# EasyEDA Pro project G-CU.eprj

# Schematic Schematic1
Manufacturer Part: BH-18650-B1BA002; Supplier Part: C2988620; Create Date: 2023-06-21; Page Name: P1; Project Name: G-CU; Schematic Name: Schematic1; Update Date: 2024-05-16; Company: 嘉立创EDA; Page Size: A4; Version: V1.0
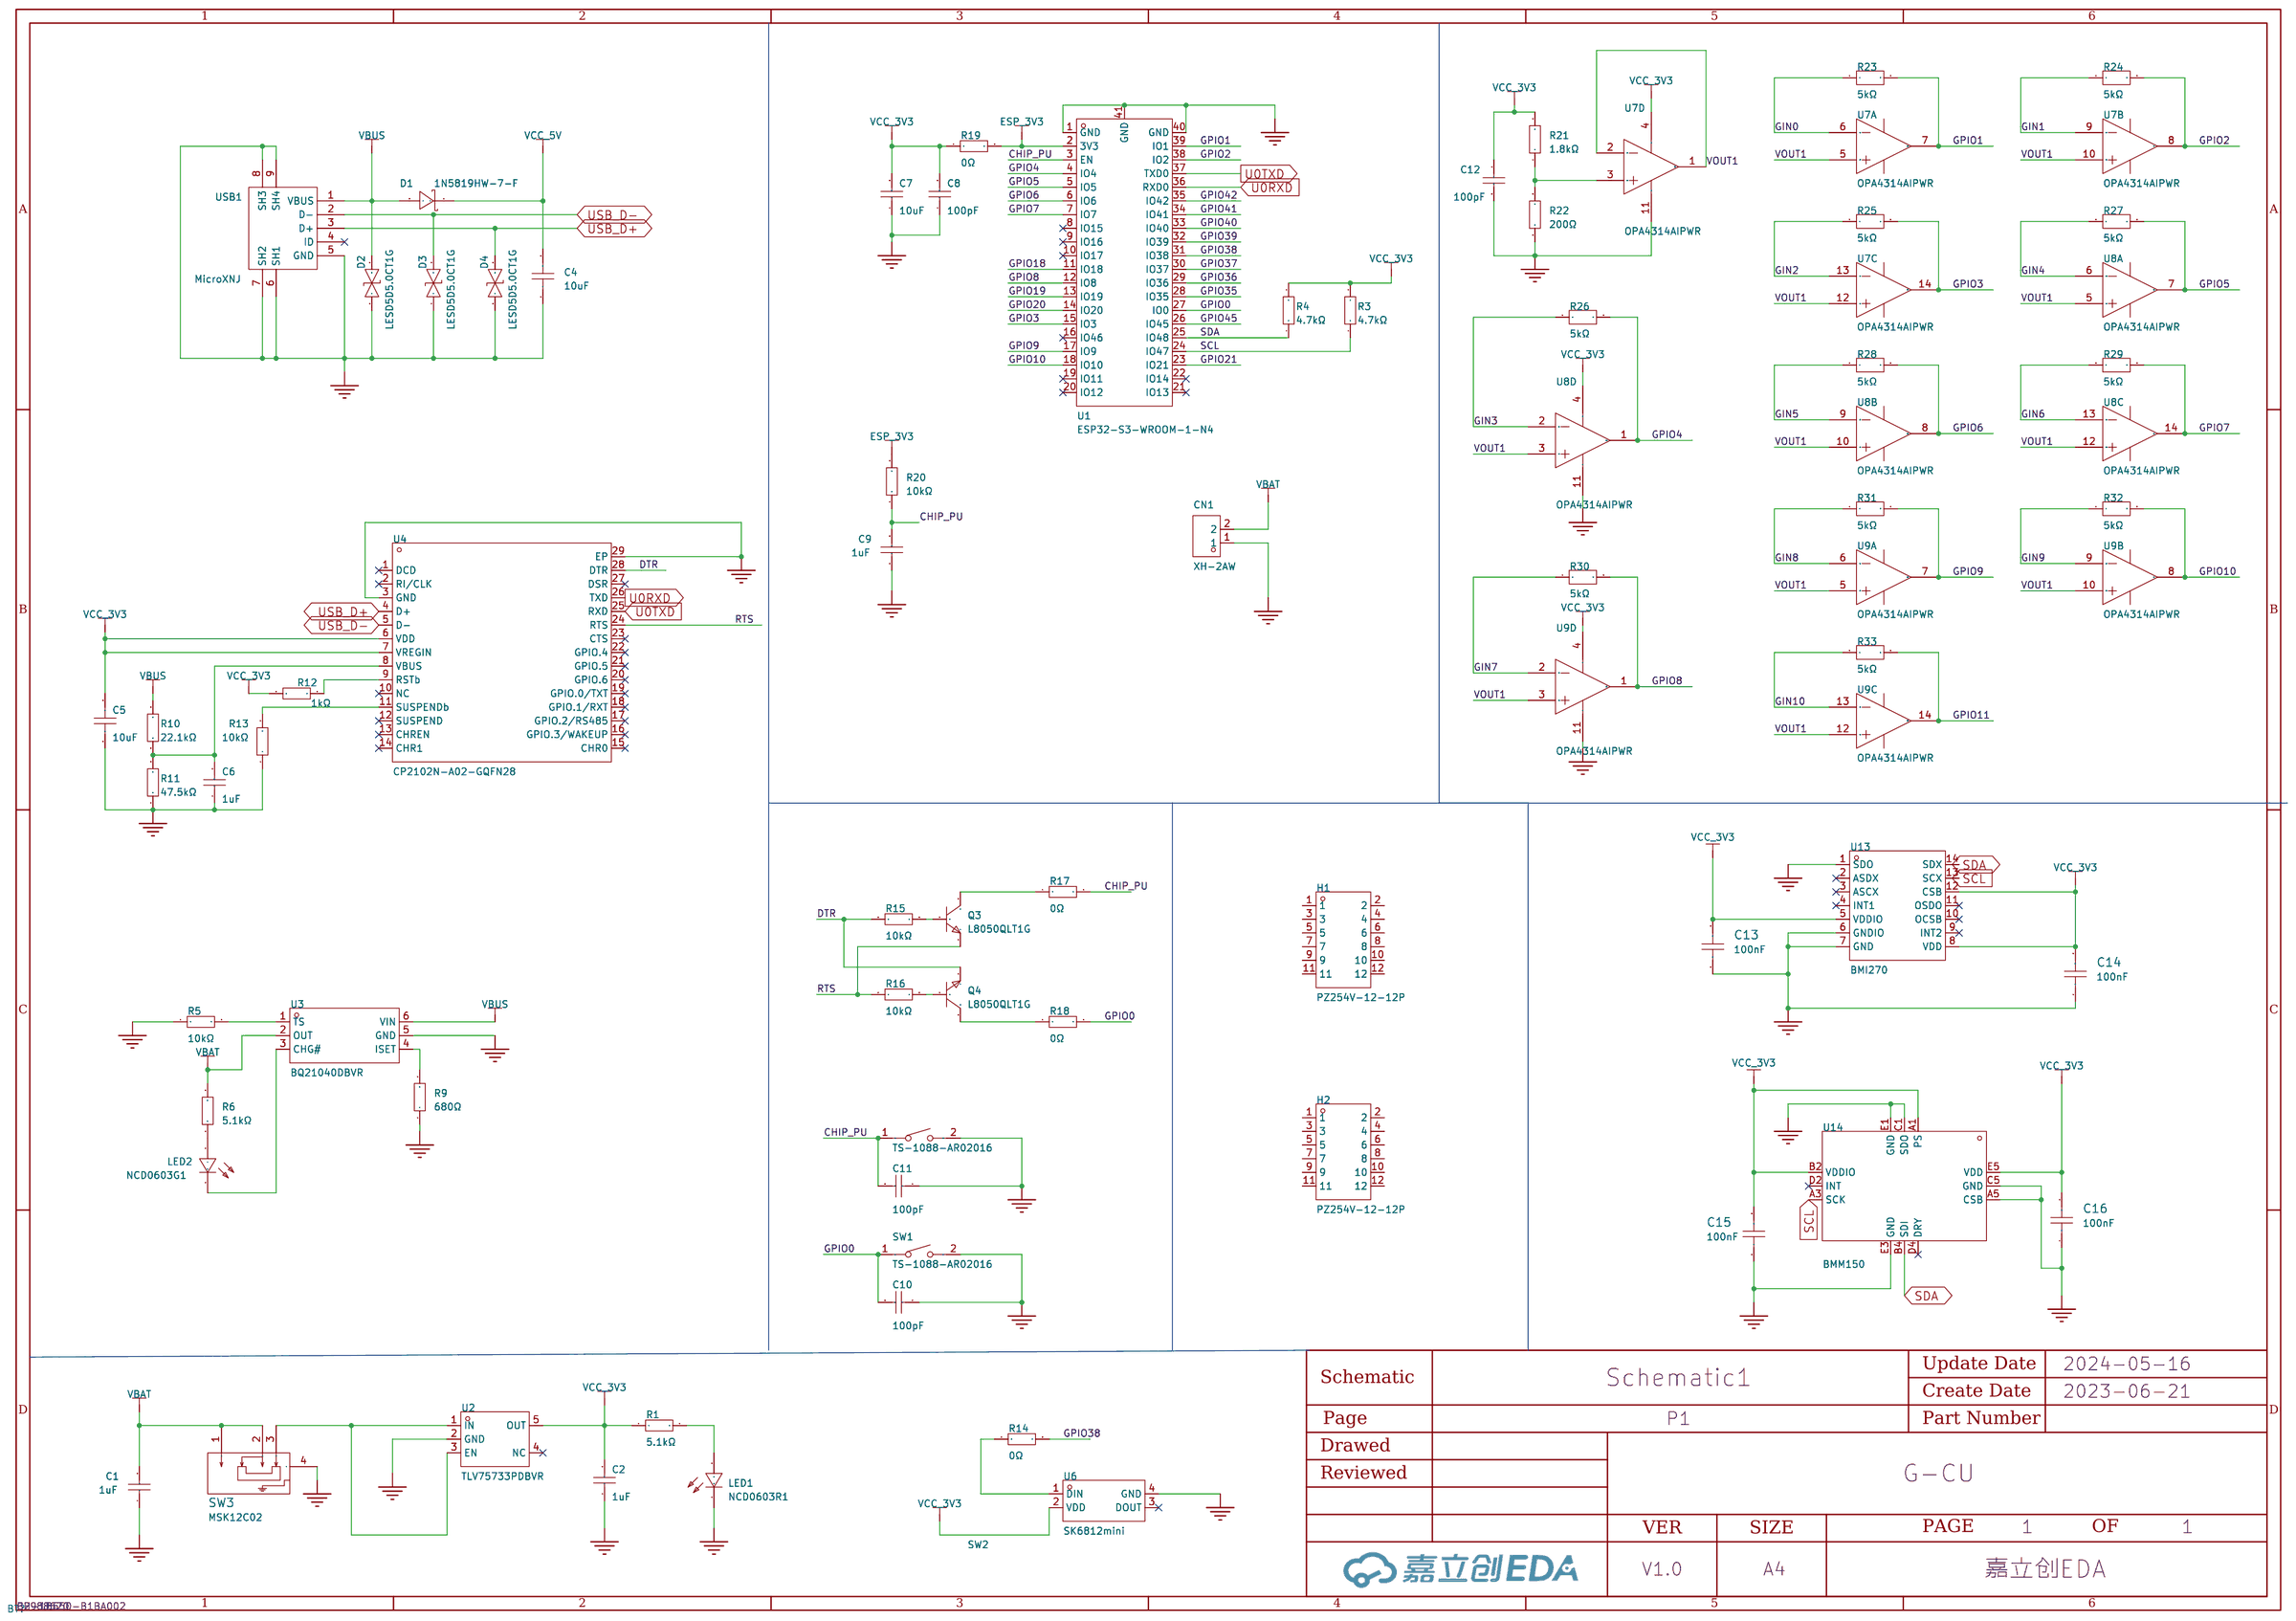
[diagram p0: schematic sheet]

## Parts
C1  1uF  [C0402]
C2  1uF  [C0402]
C4  10uF  [C0603]
C5  10uF  [C0603]
C6  1uF  [C0603]
C7  10uF  [C0402]
C8  100pF  [C0402]
C9  1uF  [C0402]
C10  100pF  [C0402]
C11  100pF  [C0402]
C12  100pF  [C0402]
C13  100nF  [C0402]
C14  100nF  [C0402]
C15  100nF  [C0402]
C16  100nF  [C0402]
CN1  XH-2AW  [CONN-TH_XH-2AW_C2908611]
D1  1N5819HW-7-F  [SOD-123_L2.7-W1.6-LS3.7-RD]
D2  LESD5D5.0CT1G  [SOD-523_L1.2-W0.8-LS1.6-BI]
D3  LESD5D5.0CT1G  [SOD-523_L1.2-W0.8-LS1.6-BI]
D4  LESD5D5.0CT1G  [SOD-523_L1.2-W0.8-LS1.6-BI]
H1  PZ254V-12-12P  [GCU-CON-v2]
H2  PZ254V-12-12P  [GCU-CON-v2]
LED1  NCD0603R1  [LED0603-RD_RED]
LED2  NCD0603G1  [LED0603-RD]
Q3  L8050QLT1G  [SOT-23-3_L2.9-W1.3-P1.90-LS2.4-BR]
Q4  L8050QLT1G  [SOT-23-3_L2.9-W1.3-P1.90-LS2.4-BR]
R1  5.1kΩ  [R0402]
R3  4.7kΩ  [R0402]
R4  4.7kΩ  [R0402]
R5  10kΩ  [R0402]
R6  5.1kΩ  [R0402]
R9  680Ω  [R0402]
R10  22.1kΩ  [R0402]
R11  47.5kΩ  [R0402]
R12  1kΩ  [R0402]
R13  10kΩ  [R0402]
R14  0Ω  [R0402]
R15  10kΩ  [R0402]
R16  10kΩ  [R0402]
R17  0Ω  [R0402]
R18  0Ω  [R0402]
R19  0Ω  [R0402]
R20  10kΩ  [R0402]
R21  1.8kΩ  [R0402]
R22  200Ω  [R0402]
R23  5kΩ  [R0603]
R24  5kΩ  [R0603]
R25  5kΩ  [R0603]
R26  5kΩ  [R0603]
R27  5kΩ  [R0603]
R28  5kΩ  [R0603]
R29  5kΩ  [R0603]
R30  5kΩ  [R0603]
R31  5kΩ  [R0603]
R32  5kΩ  [R0603]
R33  5kΩ  [R0603]
SW1  TS-1088-AR02016  [SW-SMD_L3.9-W3.0-P4.45]
SW2  TS-1088-AR02016  [SW-SMD_L3.9-W3.0-P4.45]
SW3  MSK12C02  [SW-TH_MSK12C02]
U1  ESP32-S3-WROOM-1-N4  [WIRELM-SMD_ESP32-S3-WROOM-1]
U2  TLV75733PDBVR  [SOT-23-5_L2.9-W1.6-P0.95-LS2.8-BL]
U3  BQ21040DBVR  [SOT-23-6_L2.9-W1.6-P0.95-LS2.8-BR]
U4  CP2102N-A02-GQFN28  [QFN-28_L5.0-W5.0-P0.50-TL-EP3.3]
U6  SK6812mini  [LED-SMD_4P-L3.7-W3.5-P1.75-BR-SK6812MINI]
U7  OPA4314AIPWR  [TSSOP-14_L5.0-W4.4-P0.65-LS6.4-BL]  (sections 1,2,3,4)
U8  OPA4314AIPWR  [TSSOP-14_L5.0-W4.4-P0.65-LS6.4-BL]  (sections 1,2,3,4)
U9  OPA4314AIPWR  [TSSOP-14_L5.0-W4.4-P0.65-LS6.4-BL]  (sections 1,2,3,4)
U13  BMI270  [LGA-14_L3.0-W2.5-P0.50-BR]
U14  BMM150  [WLCSP-12_L1.6-W1.6_BMM150]
USB1  MicroXNJ  [MICRO-USB-SMD_MICROXNJ]

## Library data of the parts
C1 C2 C9 = CL05A105KP5NNNC: 容值:1uF;精度:±10%;额定电压:10V;材质(温度系数):X5R;; LCSC Part Name: 1uF ±10% 10V; Supplier Part: C14445; Manufacturer: SAMSUNG(三星); Supplier Footprint: 0402; JLCPCB Part Class: Extended Part; Datasheet: https://atta.szlcsc.com/upload/public/pdf/source/20160103/1457707670698.pdf; Supplier: LCSC; Tolerance: ±10%; Voltage Rated: 10V; Temperature Coefficient: X5R
C4 C5 = CL10A106MA8NRNC: 容值:10uF;精度:±20%;额定电压:25V;材质(温度系数):X5R;; LCSC Part Name: 10uF ±20% 25V; Supplier Part: C96446; Manufacturer: SAMSUNG(三星); Supplier Footprint: 0603; JLCPCB Part Class: Basic Part; Datasheet: https://atta.szlcsc.com/upload/public/pdf/source/20170325/1490427913016.pdf; Supplier: LCSC; Tolerance: ±20%; Voltage Rated: 25V; Temperature Coefficient: X5R
C6 = CL10A105KO8NNNC: 容值:1uF;精度:±10%;额定电压:16V;材质(温度系数):X5R;; LCSC Part Name: 1uF ±10% 16V; Supplier Part: C1592; Manufacturer: SAMSUNG(三星); Supplier Footprint: 0603; JLCPCB Part Class: Extended Part; Datasheet: https://atta.szlcsc.com/upload/public/pdf/source/20220919/9FBE606BE0D9532D730F292EB26DC5BB.pdf; Supplier: LCSC; Tolerance: ±10%; Voltage Rated: 16V; Temperature Coefficient: X5R
C7 = CL05A106MQ5NUNC: 容值:10uF;精度:±20%;额定电压:6.3V;材质(温度系数):X5R;; LCSC Part Name: 10uF ±20% 6.3V; Supplier Part: C15525; Manufacturer: SAMSUNG(三星); Supplier Footprint: 0402; JLCPCB Part Class: Basic Part; Datasheet: https://atta.szlcsc.com/upload/public/pdf/source/20220823/2B02EE04F8F211D38A52DCB16EB6BEBA.pdf; Supplier: LCSC; Tolerance: ±20%; Voltage Rated: 6.3V; Temperature Coefficient: X5R
C8 C10-C12 = 0402CG101J500NT: 容值:100pF;精度:±5%;额定电压:50V;材质(温度系数):C0G;; LCSC Part Name: 100pF ±5% 50V; Supplier Part: C1546; Manufacturer: FH(风华); Supplier Footprint: 0402; JLCPCB Part Class: Basic Part; Datasheet: https://atta.szlcsc.com/upload/public/pdf/source/20170923/C1546_1506149265265988353.pdf; Supplier: LCSC; Tolerance: ±5%; Voltage Rated: 50V; Temperature Coefficient: C0G
C13-C16 = FCC0402B104K250AT: 容值:100nF;精度:±10%;额定电压:25V;材质(温度系数):X7R;; LCSC Part Name: 100nF ±10% 25V; Supplier Part: C5137489; Manufacturer: FOJAN(富捷); Supplier Footprint: 0402; JLCPCB Part Class: 扩展库; Datasheet: https://atta.szlcsc.com/upload/public/pdf/source/20220818/0EB3B7FB2F5648AC16609637FBA7DABE.pdf; Supplier: LCSC; Tolerance: ±10%; Voltage Rated: 25V; Temperature Coefficient: X7R
CN1 = XH-2AW_C2908611: 参考系列:XH;间距:2.54mm;插针结构:1x2P;排数:1;每排PIN数:2;行距:-;公母:公型插针;安装方式:弯插;额定电流:3A;工作温度范围:-25℃~+85℃;; LCSC Part Name: XH 2.54mm 1x2P 弯插; Supplier Part: C2908611; Manufacturer: HCTL(华灿天禄); Supplier Footprint: 弯插,P=2.54mm; JLCPCB Part Class: 扩展库; Datasheet: https://atta.szlcsc.com/upload/public/pdf/source/20211021/ACA2D54D99493880102FCACAC8DAABA8.pdf; Supplier: LCSC; Reference Series: XH; Pitch: 2.54mm; Pins Structure: 1x2P; Number of Rows: 1; Number of PINs Per Row: 2; Gender: 公型插针; Mounting Style: 弯插; Current Rating (Max): 3A; Operating Temperature Range: -25℃~+85℃
D1 = 1N5819HW-7-F: 直流反向耐压(Vr):40V;平均整流电流(Io):1A;正向压降(Vf):450mV@1A;; LCSC Part Name: 40V 1A 450mV@1A; Supplier Part: C82544; Manufacturer: DIODES(美台); Supplier Footprint: SOD-123; JLCPCB Part Class: Extended Part; Datasheet: https://atta.szlcsc.com/upload/public/pdf/source/20161024/1477288459223.pdf; Supplier: LCSC; Reverse Voltage (Vr): 40V; Average Rectified Current (Io): 1A; Forward Voltage (Vf@If): 450mV@1A
D2-D4 = LESD5D5.0CT1G: 极性:双向;反向截止电压(Vrwm):5V;击穿电压(VBR):5.6V;钳位电压(Vc)@Ipp:18.6V;; LCSC Part Name: 双向ESD; Supplier Part: C383211; Manufacturer: LRC(乐山无线电); Supplier Footprint: SOD-523; JLCPCB Part Class: Extended Part; Datasheet: https://atta.szlcsc.com/upload/public/pdf/source/20190807/C383211_633DF4B4E2C161403226E5235FE33A1C.pdf; Supplier: LCSC; Polarity: 双向; Reverse Stand-Off Voltage (Vrwm): 5V; Breakdown Voltage (VBR): 5.6V; Peak Pulse Current(Ipp)@8/20us: 9.4A; Clamping Voltage@Ipp: 18.6V
H1 H2 = PZ254V-12-12P: 插针结构:2x6P;间距:2.54mm;行距:2.54mm;圆针/方针:方针;安装类型:直插;排数:双排;总PIN位数:12P;额定电流:-;额定电压:-;配合针长度:6mm;塑高:2.5mm;端接针长度:3mm;触头材质:黄铜;触头镀层:-;工作温度范围:-40℃~+105℃;颜色:黑色;; LCSC Part Name: 间距:2.54mm 2x6P 直插 方针; Supplier Part: C492423; Manufacturer: XFCN(兴飞); Supplier Footprint: 插件,P=2.54mm; JLCPCB Part Class: 扩展库; Datasheet: https://atta.szlcsc.com/upload/public/pdf/source/20200309/C492423_E4E2C9BC0EB9D59A2ABE4377D2E234B2.pdf; Supplier: LCSC; Pin Structure: 2x6P; Pitch: 2.54mm; Row Spacing: 2.54mm; Circluar Pins/Square Pins: 方针; Mounting Type: 直插; Number of Rows: 双排; Number of Pins: 12P; Length of Mating Pin: 6mm; Insulation Height: 2.5mm; Length of End Connection Pin: 3mm; Contact Material: 黄铜; Operating Temperature Range: -40℃~+105℃; Color: 黑色
LED1 = NCD0603R1_C84263: 发光颜色:红灯;; LCSC Part Name: 红灯; Supplier Part: C84263; Manufacturer: 国星光电; Supplier Footprint: 0603; JLCPCB Part Class: Extended Part; Datasheet: https://atta.szlcsc.com/upload/public/pdf/source/20200820/C84263_DABC6A75E58F576973B407FDBA283D60.pdf; Supplier: LCSC; Emitted Color: 红灯
LED2 = NCD0603G1: 发光颜色:翠绿;; LCSC Part Name: 翠绿; Supplier Part: C84267; Manufacturer: 国星光电; Supplier Footprint: 0603; JLCPCB Part Class: Extended Part; Datasheet: https://atta.szlcsc.com/upload/public/pdf/source/20200820/C84267_04BA7703640BAC111D09F5EFB971FBF3.pdf; Supplier: LCSC; Emitted Color: 翠绿
Q3 Q4 = L8050QLT1G: 晶体管类型:NPN;集射极击穿电压(Vceo):25V;集电极电流(Ic):800mA;功率(Pd):225mW;; LCSC Part Name: NPN 25V 800mA; Supplier Part: C49581; Manufacturer: LRC(乐山无线电); Supplier Footprint: SOT-23; JLCPCB Part Class: Extended Part; Datasheet: https://atta.szlcsc.com/upload/public/pdf/source/20150518/1457707314424.pdf; Supplier: LCSC; Transistor Type: NPN; Collector-Emitter Breakdown Voltage (Vceo): 25V; Collector Current (Ic): 800mA; Power Dissipation (Pd): 225mW
R1 R6 = 0402WGF5101TCE: 电阻类型:厚膜电阻;阻值:5.1kΩ;精度:±1%;功率:62.5mW;; LCSC Part Name: 5.1kΩ ±1% 62.5mW; Supplier Part: C25905; Manufacturer: UNI-ROYAL(厚声); Supplier Footprint: 0402; JLCPCB Part Class: Basic Part; Datasheet: https://atta.szlcsc.com/upload/public/pdf/source/20200306/C422600_1E6D84923E4A46A82E41ADD87F860B5C.pdf; Supplier: LCSC; Type: 厚膜电阻; Tolerance: ±1%; Power(Watts): 62.5mW; Temperature Coefficient: ±100ppm/℃; Overload Voltage (Max): 50V; Operating Temperature Range: -55℃~+155℃
R3 R4 = 0402WGF4701TCE: 电阻类型:厚膜电阻;阻值:4.7kΩ;精度:±1%;功率:62.5mW;; LCSC Part Name: 4.7kΩ ±1% 62.5mW; Supplier Part: C25900; Manufacturer: UNI-ROYAL(厚声); Supplier Footprint: 0402; JLCPCB Part Class: Basic Part; Datasheet: https://atta.szlcsc.com/upload/public/pdf/source/20200306/C422600_1E6D84923E4A46A82E41ADD87F860B5C.pdf; Supplier: LCSC; Type: 厚膜电阻; Tolerance: ±1%; Power(Watts): 62.5mW; Temperature Coefficient: ±100ppm/℃; Overload Voltage (Max): 50V; Operating Temperature Range: -55℃~+155℃
R5 R13 R15 R16 R20 = 0402WGF1002TCE: 电阻类型:厚膜电阻;阻值:10kΩ;精度:±1%;功率:62.5mW;; LCSC Part Name: 10kΩ ±1% 62.5mW; Supplier Part: C25744; Manufacturer: UNI-ROYAL(厚声); Supplier Footprint: 0402; JLCPCB Part Class: Basic Part; Datasheet: https://atta.szlcsc.com/upload/public/pdf/source/20200306/C422600_1E6D84923E4A46A82E41ADD87F860B5C.pdf; Supplier: LCSC; Type: 厚膜电阻; Tolerance: ±1%; Power(Watts): 62.5mW; Temperature Coefficient: ±100ppm/℃; Overload Voltage (Max): 50V; Operating Temperature Range: -55℃~+155℃
R9 = 0402WGF6800TCE: 电阻类型:厚膜电阻;阻值:680Ω;精度:±1%;功率:62.5mW;; LCSC Part Name: 680Ω ±1% 62.5mW; Supplier Part: C25130; Manufacturer: UNI-ROYAL(厚声); Supplier Footprint: 0402; JLCPCB Part Class: Basic Part; Datasheet: https://atta.szlcsc.com/upload/public/pdf/source/20200306/C422600_1E6D84923E4A46A82E41ADD87F860B5C.pdf; Supplier: LCSC; Type: 厚膜电阻; Tolerance: ±1%; Power(Watts): 62.5mW; Temperature Coefficient: ±100ppm/℃; Overload Voltage (Max): 50V; Operating Temperature Range: -55℃~+155℃
R10 = 0402WGF2212TCE: 电阻类型:厚膜电阻;阻值:22.1kΩ;精度:±1%;功率:62.5mW;; LCSC Part Name: 22.1kΩ ±1% 62.5mW; Supplier Part: C43473; Manufacturer: UNI-ROYAL(厚声); Supplier Footprint: 0402; JLCPCB Part Class: Extended Part; Datasheet: https://atta.szlcsc.com/upload/public/pdf/source/20200306/C422600_1E6D84923E4A46A82E41ADD87F860B5C.pdf; Supplier: LCSC; Type: 厚膜电阻; Tolerance: ±1%; Power(Watts): 62.5mW; Temperature Coefficient: ±100ppm/℃; Overload Voltage (Max): 50V; Operating Temperature Range: -55℃~+155℃
R11 = 0402WGF4752TCE: 电阻类型:厚膜电阻;阻值:47.5kΩ;精度:±1%;功率:62.5mW;; LCSC Part Name: 47.5kΩ ±1% 62.5mW; Supplier Part: C25896; Manufacturer: UNI-ROYAL(厚声); Supplier Footprint: 0402; JLCPCB Part Class: Extended Part; Datasheet: https://atta.szlcsc.com/upload/public/pdf/source/20200306/C422600_1E6D84923E4A46A82E41ADD87F860B5C.pdf; Supplier: LCSC; Type: 厚膜电阻; Tolerance: ±1%; Power(Watts): 62.5mW; Temperature Coefficient: ±100ppm/℃; Overload Voltage (Max): 50V; Operating Temperature Range: -55℃~+155℃
R12 = 0402WGF1001TCE: 电阻类型:厚膜电阻;阻值:1kΩ;精度:±1%;功率:62.5mW;; LCSC Part Name: 1kΩ ±1% 62.5mW; Supplier Part: C11702; Manufacturer: UNI-ROYAL(厚声); Supplier Footprint: 0402; JLCPCB Part Class: Basic Part; Datasheet: https://atta.szlcsc.com/upload/public/pdf/source/20200306/C422600_1E6D84923E4A46A82E41ADD87F860B5C.pdf; Supplier: LCSC; Type: 厚膜电阻; Tolerance: ±1%; Power(Watts): 62.5mW; Temperature Coefficient: ±100ppm/℃; Overload Voltage (Max): 50V; Operating Temperature Range: -55℃~+155℃
R14 R17-R19 = 0402WGJ0000TCE: 电阻类型:厚膜电阻;阻值:0Ω;精度:±5%;功率:62.5mW;; LCSC Part Name: 0Ω ±5% 62.5mW; Supplier Part: C21376; Manufacturer: UNI-ROYAL(厚声); Supplier Footprint: 0402; JLCPCB Part Class: Extended Part; Datasheet: https://atta.szlcsc.com/upload/public/pdf/source/20200306/C422600_1E6D84923E4A46A82E41ADD87F860B5C.pdf; Supplier: LCSC; Type: 厚膜电阻; Tolerance: ±5%; Power(Watts): 62.5mW; Overload Voltage (Max): 50V; Operating Temperature Range: -55℃~+155℃
R21 = 0402WGF1801TCE: 电阻类型:厚膜电阻;阻值:1.8kΩ;精度:±1%;功率:62.5mW;; LCSC Part Name: 1.8kΩ ±1% 62.5mW; Supplier Part: C25871; Manufacturer: UNI-ROYAL(厚声); Supplier Footprint: 0402; JLCPCB Part Class: Extended Part; Datasheet: https://atta.szlcsc.com/upload/public/pdf/source/20200306/C422600_1E6D84923E4A46A82E41ADD87F860B5C.pdf; Supplier: LCSC; Type: 厚膜电阻; Tolerance: ±1%; Power(Watts): 62.5mW; Temperature Coefficient: ±100ppm/℃; Overload Voltage (Max): 50V; Operating Temperature Range: -55℃~+155℃
R22 = 0402WGF2000TCE: 电阻类型:厚膜电阻;阻值:200Ω;精度:±1%;功率:62.5mW;; LCSC Part Name: 200Ω ±1% 62.5mW; Supplier Part: C25087; Manufacturer: UNI-ROYAL(厚声); Supplier Footprint: 0402; JLCPCB Part Class: Basic Part; Datasheet: https://atta.szlcsc.com/upload/public/pdf/source/20200306/C422600_1E6D84923E4A46A82E41ADD87F860B5C.pdf; Supplier: LCSC; Type: 厚膜电阻; Tolerance: ±1%; Power(Watts): 62.5mW; Temperature Coefficient: ±100ppm/℃; Overload Voltage (Max): 50V; Operating Temperature Range: -55℃~+155℃
R23-R33 = AR03BTCX5001: 电阻类型:薄膜电阻;阻值:5kΩ;精度:±0.1%;功率:100mW;; LCSC Part Name: 5kΩ ±0.1% 100mW; Supplier Part: C2828621; Manufacturer: Viking(光颉); Supplier Footprint: 0603; JLCPCB Part Class: Extended Part; Datasheet: https://atta.szlcsc.com/upload/public/pdf/source/20211009/C2828621_7F88408CB1D09DFC08036051E0A6050B.pdf; Supplier: LCSC; Type: 薄膜电阻; Tolerance: ±0.1%; Power(Watts): 100mW; Temperature Coefficient: ±25ppm/℃; Overload Voltage (Max): 50V; Operating Temperature Range: -55℃~+155℃
SW1 SW2 = TS-1088-AR02016: 触点电流:50mA;额定电压(DC):12V;绝缘电阻:100MΩ;电路结构:单刀单掷;安装方式:立贴;作用力:160gf@±50gf;机械寿命:10万次;带支架:否;; LCSC Part Name: 4*3*2mm 立贴 轻触开关; Supplier Part: C720477; Manufacturer: XUNPU(讯普); Supplier Footprint: SMD; JLCPCB Part Class: Extended Part; Datasheet: https://atta.szlcsc.com/upload/public/pdf/source/20200810/C720475_60D09DD6C54279ADDB2DC25100F1CC11.pdf; Supplier: LCSC; Contact Current: 50mA; Voltage Rating (DC): 12V; Insulation Resistance: 100MΩ; Circuit: 单刀单掷; Mounting Style: 立贴; Actuator Style: 圆形按钮; Actuator/Cap Color: 黑色; Operating Force: 160gf@±50gf; Mechanical Life: 10万次; Operating Temperature: -30℃~+80℃; Pin Style: SMD接片; Switch Length: 4mm; Switch Width: 3mm; Switch Height: 2mm; Strike Gundam: 否
SW3 = MSK12C02: LCSC Part Name: 两档侧拨贴片 7脚 拨动 白柄 柄长1.5mm,带定位柱; Supplier Part: C431540; Manufacturer: SHOU HAN(首韩); Supplier Footprint: SMD; JLCPCB Part Class: 扩展库; Supplier: LCSC
U1 = ESP32-S3-WROOM-1: LCSC Part Name: ESP32-S2-SOLO-2-N4; Supplier Part: C2913197; Manufacturer: ESPRESSIF(乐鑫); JLCPCB Part Class: Extended Part; Datasheet: https://atta.szlcsc.com/upload/public/pdf/source/20220829/68E69EF550BFD22B9418B9E05FF4E453.pdf; Supplier: LCSC
U2 = TLV75733PDBVR: 输出类型:固定;输出极性:正;输出通道数:1;最大输入电压:5.5V;输出电压:3.3V;压差:475mV@(1A);输出电流:1A;电源纹波抑制比(PSRR):52dB;; LCSC Part Name: 正 Vin=5.5V Vout=3.3V 1A 52dB; Supplier Part: C485517; Manufacturer: TI(德州仪器); Supplier Footprint: SOT-23-5; JLCPCB Part Class: Extended Part; Datasheet: https://atta.szlcsc.com/upload/public/pdf/source/20200225/C485517_6B29D09EDAFD9A781E45EE8E3C6E09A4.pdf; Supplier: LCSC; Output Type: 固定; Output Polarity: 正; Number of Outputs: 1; Maximum Input Voltage: 5.5V; Output Voltage: 3.3V; Dropout Voltage: 475mV@(1A); Output Current: 1A; Power Supply Rejection Ratio (PSRR): 52dB
U3 = BQ21040DBVR: 电池类型:锂离子/聚合物;电池节数:1;最大充电电流:800mA;电源电压:6.45V;; Supplier Part: C202311; Manufacturer: TI(德州仪器); Supplier Footprint: SOT-23-6; JLCPCB Part Class: Extended Part; Datasheet: https://atta.szlcsc.com/upload/public/pdf/source/20180412/C202311_69E9FC455D67F52C33ED3C60972DCB90.pdf; Supplier: LCSC; Type of Battery: 锂离子/聚合物; Number of Cells: 1; Maximum Charge Current: 800mA; Supply Voltage: 6.45V; Operating Temperature: 0℃~+125℃
U4 = CP2102N-A02-GQFN28: Supplier Part: C1550553; Manufacturer: SILICON LABS(芯科); Supplier Footprint: QFN-28(5x5); JLCPCB Part Class: Extended Part; Datasheet: https://atta.szlcsc.com/upload/public/pdf/source/20201204/C964632_F2B790CC23A72455AEF523510305B30A.pdf; Supplier: LCSC
U6 = SK6812mini: Supplier Part: C2886570; Manufacturer: 欧思科光电; Supplier Footprint: SMD; JLCPCB Part Class: Extended Part; Datasheet: https://atta.szlcsc.com/upload/public/pdf/source/20230417/4A68877D1EE94768BDE7A1DE8196F30D.pdf; Supplier: LCSC
U7-U9 = OPA4314AIPWR: OPA4314 四路、3MHz、低功耗、低噪声、RRI/O、1.8V CMOS 运算放大器; Supplier Part: C129333; Manufacturer: TI(德州仪器); Supplier Footprint: TSSOP-14; JLCPCB Part Class: Extended Part; Datasheet: https://atta.szlcsc.com/upload/public/pdf/source/20170914/C129333_1505359967979968173.pdf; Supplier: LCSC
U13 = BMI270: IMU-惯性测量单元; Supplier Part: C2836813; Manufacturer: Bosch(博世); Supplier Footprint: LGA-14(2.5x3); JLCPCB Part Class: 扩展库; Datasheet: https://atta.szlcsc.com/upload/public/pdf/source/20210625/C2836813_35E1F3F92097F45A3828DF13DDBA01A5.pdf; Supplier: LCSC
U14 = BMM150: 磁传感器 3轴磁罗盘; LCSC Part Name: 三轴地磁式传感器; Supplier Part: C171681; Manufacturer: Bosch(博世); Supplier Footprint: WLCSP-12; JLCPCB Part Class: 扩展库; Datasheet: https://atta.szlcsc.com/upload/public/pdf/source/20180327/C171681_AC95244FE88EF9D8F701E0ABF38F9AC1.pdf; Supplier: LCSC
USB1 = MicroXNJ: 连接器类型:Micro-B;标准:USB 2.0;公母:母座;触点数量:5;端口数量:1;安装方式:卧贴;额定电流 - 电源:1A;工作温度范围:-20℃~+85℃;; LCSC Part Name: Micro-B 母座 卧贴; Supplier Part: C404969; Manufacturer: SHOU HAN(首韩); Supplier Footprint: SMD; JLCPCB Part Class: Extended Part; Datasheet: https://atta.szlcsc.com/upload/public/pdf/source/20220415/2494EDFF499AF6F852F7C820374B6AF3.pdf; Supplier: LCSC; Connector Type: Micro-B; Standard: USB 2.0; Gender: 母座; Number of Contacts: 5; Number of Ports: 1; Mounting Style: 卧贴; Current Rating - Power (Max): 1A; Operating Temperature Range: -20℃~+85℃

## Nets
GND: C1.1 C2.1 C4.1 C5.1 C6.1 C7.1 C8.1 C9.1 C10.1 C11.1 C12.2 C13.1 C14.1 C15.1 C16.1 CN1.1 D2.1 D3.1 D4.1 LED1.1(K) R5.1 R9.1 R11.1 R13.1 R22.1 SW1.2 SW2.2 SW3.4 U1.1(GND) U1.40(GND) U1.41(GND) U2.2(GND) U3.5(GND) U4.3(GND) U4.29(EP) U6.4(GND) U7.11(V-) U8.11(V-) U9.11(V-) U13.1(SDO) U13.6(GNDIO) U13.7(GND) U14.A5(CSB) U14.C1(SDO) U14.C5(GND) U14.E1(GND) U14.E3(GND) USB1.5(GND) USB1.6(SH1) USB1.7(SH2) USB1.8(SH3) USB1.9(SH4)
VBAT: C1.2 CN1.2 R6.2 SW3.1 SW3.2 U3.2(OUT)
VBUS: D1.2(A) D2.2 R10.2 U3.6(VIN) USB1.1(VBUS)
VCC_3V3: C2.2 C5.2 C7.2 C8.2 C12.1 C13.2 C14.2 C15.2 C16.2 R1.1 R3.2 R4.2 R12.2 R19.1 R21.2 U2.5(OUT) U4.6(VDD) U4.7(VREGIN) U6.2(VDD) U7.4(V+) U8.4(V+) U9.4(V+) U13.5(VDDIO) U13.8(VDD) U13.12(CSB) U14.A1(PS) U14.B2(VDDIO) U14.E5(VDD)
VCC_5V: C4.2 D1.1(K)
CHIP_PU: C9.2 C11.2 R17.2 R20.1 SW2.1 U1.3(EN)
DTR: Q4.2(E) R15.1 U4.28(DTR)
ESP_3V3: R19.2 R20.2 U1.2(3V3)
GIN0: R23.1 U7.6(IN B-)
GIN1: R24.1 U7.9(IN C-)
GIN2: R25.1 U7.13(IN D-)
GIN3: R26.1 U8.2(IN A-)
GIN4: R27.1 U8.6(IN B-)
GIN5: R28.1 U8.9(IN C-)
GIN6: R29.1 U8.13(IN D-)
GIN7: R30.1 U9.2(IN A-)
GIN8: R31.1 U9.6(IN B-)
GIN9: R32.1 U9.9(IN C-)
GIN10: R33.1 U9.13(IN D-)
GPIO0: C10.2 R18.2 SW1.1 U1.27(IO0)
GPIO1: R23.2 U1.39(IO1) U7.7(OUT B)
GPIO2: R24.2 U1.38(IO2) U7.8(OUT C)
GPIO3: R25.2 U1.15(IO3) U7.14(OUT D)
GPIO4: R26.2 U1.4(IO4) U8.1(OUT A)
GPIO5: R27.2 U1.5(IO5) U8.7(OUT B)
GPIO6: R28.2 U1.6(IO6) U8.8(OUT C)
GPIO7: R29.2 U1.7(IO7) U8.14(OUT D)
GPIO8: R30.2 U1.12(IO8) U9.1(OUT A)
GPIO9: R31.2 U1.17(IO9) U9.7(OUT B)
GPIO10: R32.2 U1.18(IO10) U9.8(OUT C)
GPIO11: R33.2 U9.14(OUT D)
GPIO18: U1.11(IO18)
GPIO19: U1.13(IO19)
GPIO20: U1.14(IO20)
GPIO21: U1.23(IO21)
GPIO35: U1.28(IO35)
GPIO36: U1.29(IO36)
GPIO37: U1.30(IO37)
GPIO38: R14.2 U1.31(IO38)
GPIO39: U1.32(IO39)
GPIO40: U1.33(IO40)
GPIO41: U1.34(IO41)
GPIO42: U1.35(IO42)
GPIO45: U1.26(IO45)
RTS: Q3.2(E) R16.1 U4.24(RTS)
SCL: R3.1 U1.24(IO47) U13.13(SCX) U14.A3(SCK)
SDA: R4.1 U1.25(IO48) U13.14(SDX) U14.B4(SDI)
U0RXD: U1.36(RXD0) U4.26(TXD)
U0TXD: U1.37(TXD0) U4.25(RXD)
USB_D+: D4.2 U4.4(D+) USB1.3(D+)
USB_D-: D3.2 U4.5(D-) USB1.2(D-)
VOUT1: U7.1(OUT A) U7.2(IN A-) U7.5(IN B+) U7.10(IN C+) U7.12(IN D+) U8.3(IN A+) U8.5(IN B+) U8.10(IN C+) U8.12(IN D+) U9.3(IN A+) U9.5(IN B+) U9.10(IN C+) U9.12(IN D+)
$1N2540: LED1.2(A) R1.2
$1N5698: R5.2 U3.1(TS)
$1N5744: LED2.2(A) R6.1
$1N5776: LED2.1(K) U3.3(CHG#)
$1N6032: R9.2 U3.4(ISET)
$1N7305: C6.2 R10.1 R11.2 U4.8(VBUS)
$1N7502: R12.1 U4.9(RSTb)
$1N7540: R13.2 U4.11(SUSPENDb)
$1N7794: R14.1 U6.1(DIN)
$1N8190: Q3.3(C) R17.1
$1N8194: Q4.3(C) R18.1
$1N8229: Q3.1(B) R15.2
$1N8232: Q4.1(B) R16.2
$1N11489: R21.1 R22.2 U7.3(IN A+)
$1N12314: SW3.3 U2.1(IN) U2.3(EN)

Not connected (* = marked no-connect by the designer): H1 1 2 3 4 5 6 7 8 9 10 11 12; H2 1 2 3 4 5 6 7 8 9 10 11 12; U1 8(IO15)* 9(IO16)* 10(IO17)* 16(IO46)* 19(IO11)* 20(IO12)* 21(IO13)* 22(IO14)*; U2 4(NC)*; U4 1(DCD)* 2(RI/CLK)* 10(NC)* 12(SUSPEND)* 13(CHREN)* 14(CHR1)* 15(CHR0)* 16(GPIO.3/WAKEUP)* 17(GPIO.2/RS485)* 18(GPIO.1/RXT)* 19(GPIO.0/TXT)* 20(GPIO.6)* 21(GPIO.5)* 22(GPIO.4)* 23(CTS)* 27(DSR)*; U6 3(DOUT)*; U13 2(ASDX)* 3(ASCX)* 4(INT1)* 9(INT2)* 10(OCSB)* 11(OSDO)*; U14 D2(INT)* D4(DRY)*; USB1 4(ID)*

# Board PCB1
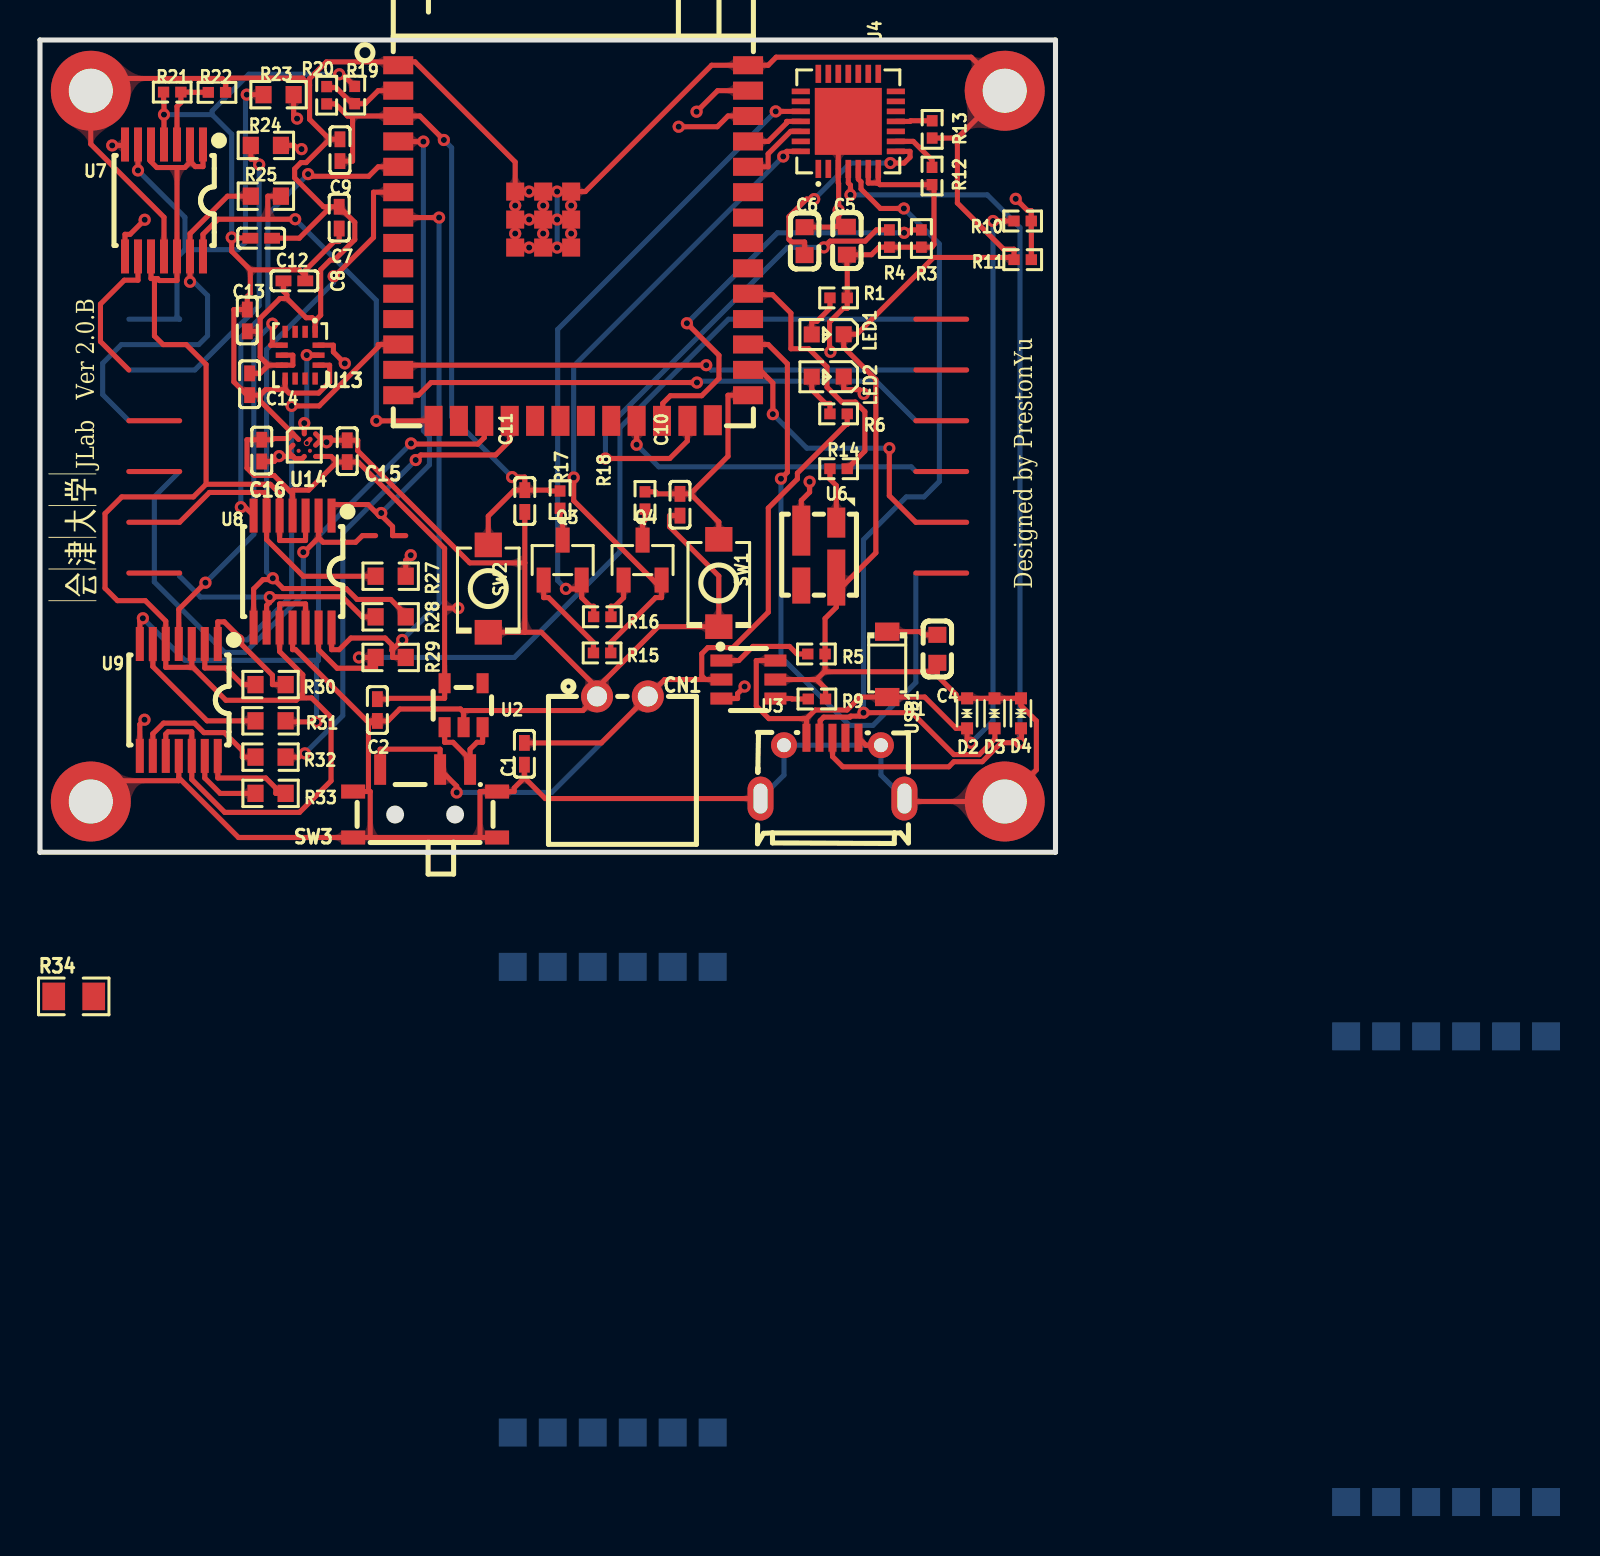
[diagram p1: board, top side]
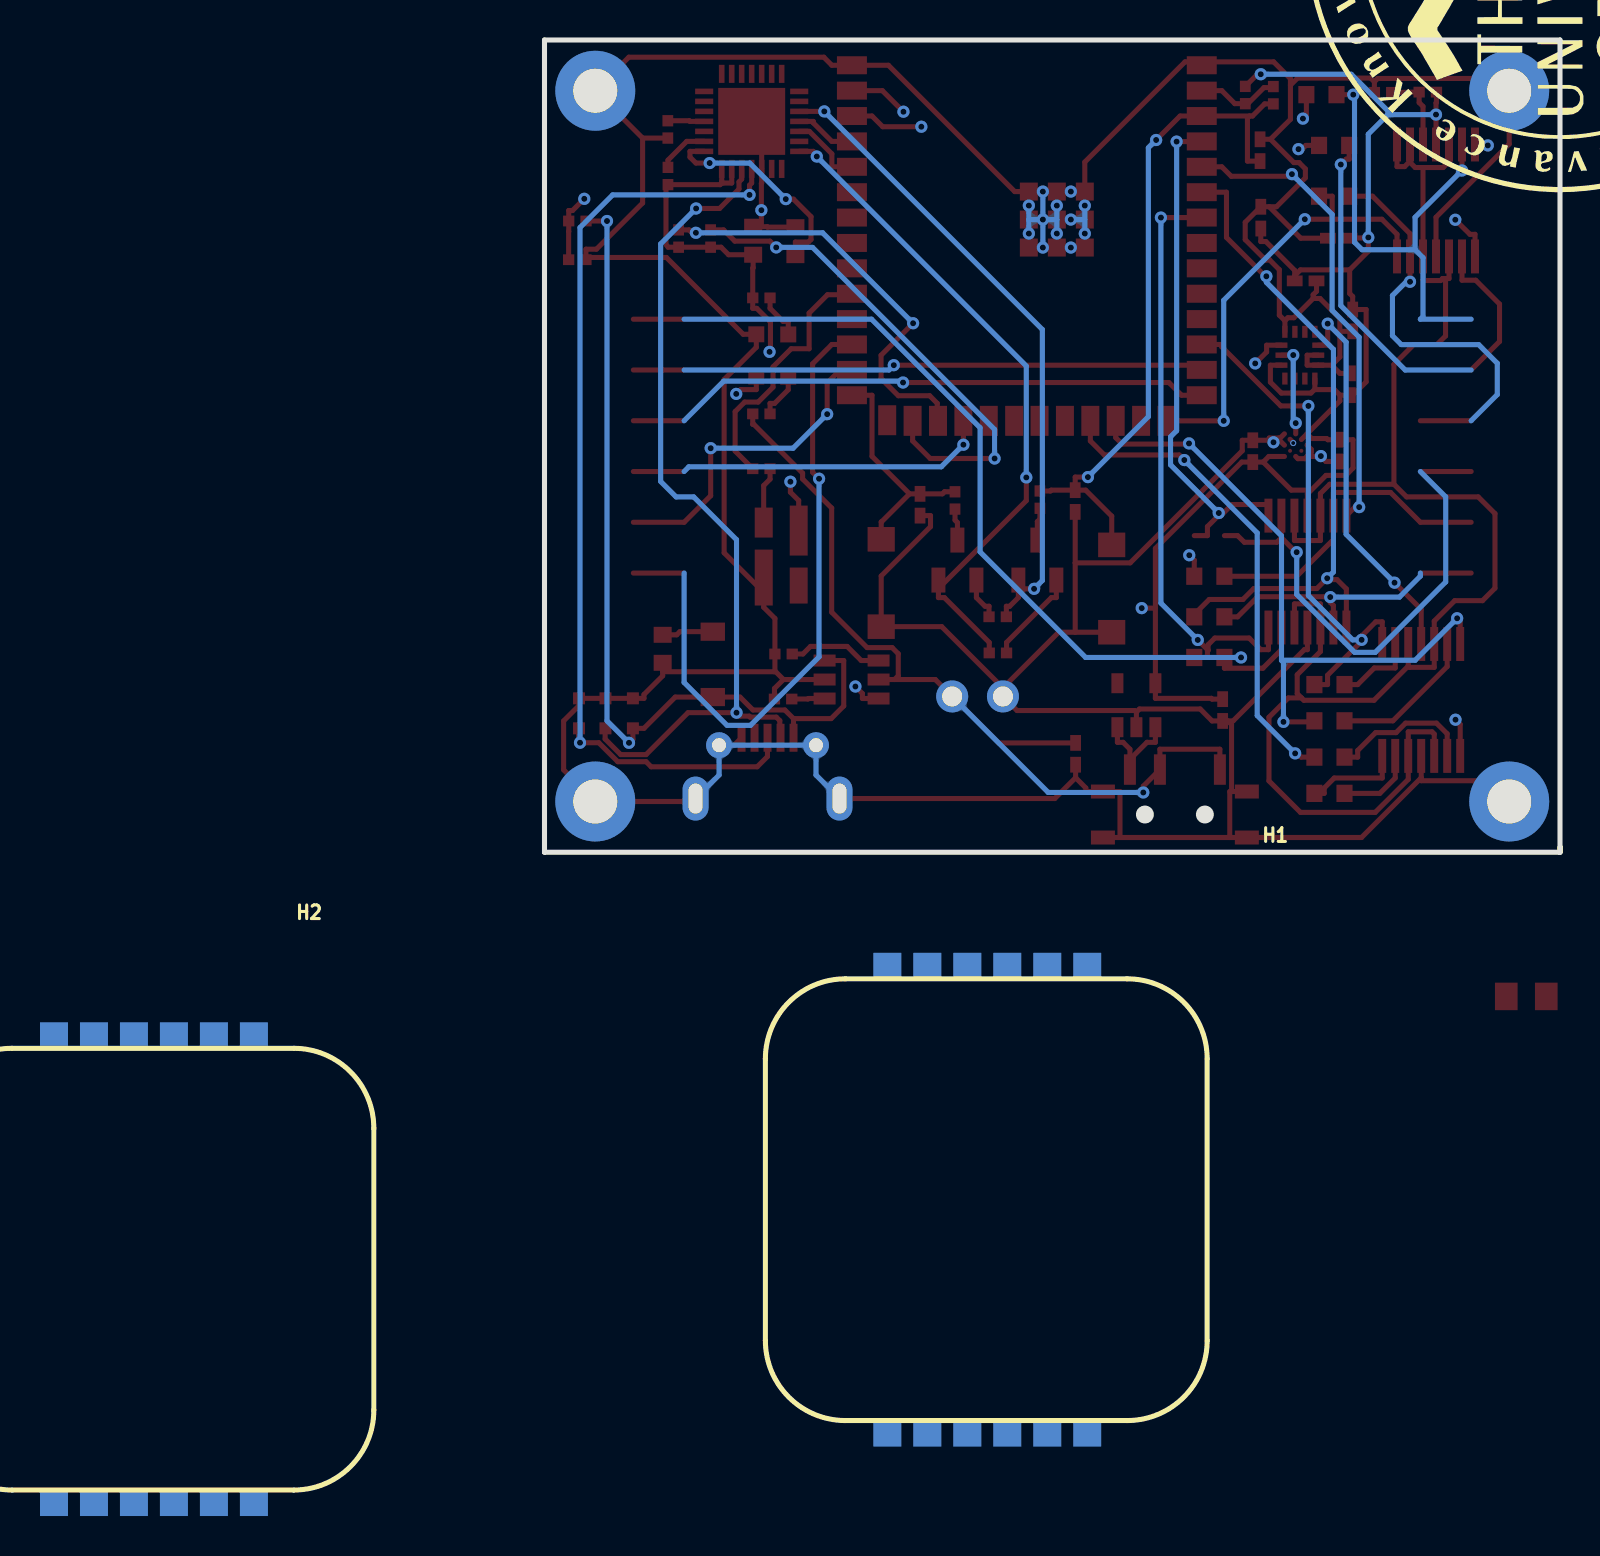
[diagram p2: board, bottom side, seen from below]

Outline 50.8 x 40.64 mm; copper layers: Top Layer, 地线屏蔽层, 信号层1, Bottom Layer. Coordinates in mm from the lower left corner of the outline.
Outline path: 0,40.64 0,0 50.8,0 50.8,40.64 0,40.64
Stack: Top Layer 0.035mm 外层铜厚1oz / Dielectric1 0.2104mm 7628 RC49% 8.6mil / 地线屏蔽层 0.035mm - / Dielectric2 1.065mm 1.1mm H/HOZ 含铜 / 信号层1 0.035mm - / Dielectric3 0.2104mm 7628 RC49% 8.6mil / Bottom Layer 0.035mm 外层铜厚1oz

## Design rules (mm)
template: JLCPCB Capability(Multiple Layers Board)
spacing copperThickness1oz (default): track to track 0.102, other pairs 0.152 to 0.3
spacing copperThickness2oz: track to track 0.203, other pairs 0.152 to 0.3
spacing copperThicknessInner0.5oz: track to track 0.089, other pairs 0.152 to 0.3
track width copperThickness1oz (default): min 0.102, default 0.254, max 2.54
track width copperThickness2oz: min 0.203, default 0.254, max 2.54
track width copperThickness0.5oz: min 0.089, default 0.254, max 2.54
differential pair differentialPair (default): width min 0.127, default 0.254, max 2.54; gap min 0.152, default 0.152
via viaSize (default): diameter min 0.3, default 0.61, max 10; hole min 0.2, default 0.305, max 6.3

## Placement (name value [footprint] x y rotation side)
C1  1uF  [c0402]  24.23 4.93 90 top
C2  1uF  [C0402]  16.88 7.11 90 top
C4  10uF  [C0603]  44.89 10.18 90 top
C5  10uF  [C0603]  40.36 30.59 270 top
C6  1uF  [C0603]  38.25 30.57 270 top
C7  10uF  [C0402]  14.97 31.75 270 top
C8  100pF  [C0402]  12.73 28.59 0 top
C9  1uF  [C0402]  15.01 35.12 270 top
C10  100pF  [C0402]  32.02 17.39 90 top
C11  100pF  [C0402]  24.25 17.57 90 top
C12  100pF  [C0402]  11.07 30.72 0 top
C13  100nF  [C0402]  10.37 26.61 90 top
C14  100nF  [C0402]  10.49 23.41 270 top
C15  100nF  [C0402]  15.37 20.07 270 top
C16  100nF  [C0402]  11.09 20.09 90 top
CN1  XH-2AW  [CONN-TH_XH-2AW_C2908611]  29.14 7.8 0 top
D1  1N5819HW-7-F  [SOD-123_L2.7-W1.6-LS3.7-RD]  42.38 9.4 270 top
D2  LESD5D5.0CT1G  [SOD-523_L1.2-W0.8-LS1.6-BI]  46.38 6.95 270 top
D3  LESD5D5.0CT1G  [SOD-523_L1.2-W0.8-LS1.6-BI]  47.75 6.95 270 top
D4  LESD5D5.0CT1G  [SOD-523_L1.2-W0.8-LS1.6-BI]  49.07 6.95 270 top
H1  PZ254V-12-12P  [GCU-CON-v2]  17.65 -6.33 270 bottom
H2  PZ254V-12-12P  [GCU-CON-v2]  59.34 -9.81 270 bottom
LED1  NCD0603R1  [LED0603-RD_RED]  39.41 25.91 180 top
LED2  NCD0603G1  [LED0603-RD]  39.41 23.8 180 top
NOREF  -  [Pad_e33]  2.54 2.54 0 top
NOREF#2  -  [Pad_e21]  48.26 2.54 0 top
NOREF#3  -  [Pad_e35]  48.26 38.1 0 top
NOREF#4  -  [Pad_e19]  2.54 38.1 0 top
Q3  L8050QLT1G  [SOT-23-3_L2.9-W1.3-P1.90-LS2.4-BR]  26.15 14.62 270 top
Q4  L8050QLT1G  [SOT-23-3_L2.9-W1.3-P1.90-LS2.4-BR]  30.14 14.62 270 top
R1  5.1kΩ  [R0402]  39.95 27.74 180 top
R3  4.7kΩ  [R0402]  44.09 30.7 270 top
R4  4.7kΩ  [R0402]  42.49 30.7 270 top
R5  10kΩ  [R0402]  38.84 9.92 180 top
R6  5.1kΩ  [R0402]  39.95 21.93 0 top
R9  680Ω  [R0402]  38.86 7.67 180 top
R10  22.1kΩ  [R0402]  49.16 31.58 180 top
R11  47.5kΩ  [R0402]  49.16 29.65 0 top
R12  1kΩ  [R0402]  44.62 33.83 270 top
R13  10kΩ  [R0402]  44.63 36.16 90 top
R14  0Ω  [R0402]  39.95 19.19 0 top
R15  10kΩ  [R0402]  28.12 9.97 180 top
R16  10kΩ  [R0402]  28.13 11.78 0 top
R17  0Ω  [R0402]  26.02 17.64 90 top
R18  0Ω  [R0402]  30.27 17.6 90 top
R19  0Ω  [R0402]  15.74 37.88 270 top
R20  10kΩ  [R0402]  14.34 37.87 90 top
R21  1.8kΩ  [R0402]  6.61 38.03 180 top
R22  200Ω  [R0402]  8.85 38.02 180 top
R23  5kΩ  [R0603]  11.93 37.9 0 top
R24  5kΩ  [R0603]  11.3 35.36 0 top
R25  5kΩ  [R0603]  11.3 32.82 0 top
R27  5kΩ  [R0603]  17.54 13.81 0 top
R28  5kΩ  [R0603]  17.54 11.78 0 top
R29  5kΩ  [R0603]  17.54 9.75 0 top
R30  5kΩ  [R0603]  11.53 8.39 0 top
R31  5kΩ  [R0603]  11.53 6.57 0 top
R32  5kΩ  [R0603]  11.53 4.76 0 top
R33  5kΩ  [R0603]  11.53 2.95 0 top
R34  10kΩ  [R0805]  1.69 -7.21 0 top
SW1  TS-1088-AR02016  [SW-SMD_L3.9-W3.0-P4.45]  33.96 13.47 270 top
SW2  TS-1088-AR02016  [SW-SMD_L3.9-W3.0-P4.45]  22.43 13.19 270 top
SW3  MSK12C02  [SW-TH_MSK12C02]  19.27 2.44 0 top
U1  ESP32-S3-WROOM-1-N4  [WIRELM-SMD_ESP32-S3-WROOM-1]  26.67 30.48 0 top
U2  TLV75733PDBVR  [SOT-23-5_L2.9-W1.6-P0.95-LS2.8-BL]  21.19 7.36 0 top
U3  BQ21040DBVR  [SOT-23-6_L2.9-W1.6-P0.95-LS2.8-BR]  35.44 8.64 180 top
U4  CP2102N-A02-GQFN28  [QFN-28_L5.0-W5.0-P0.50-TL-EP3.3]  40.44 36.57 90 top
U6  SK6812mini  [LED-SMD_4P-L3.7-W3.5-P1.75-BR-SK6812MINI]  38.96 14.92 90 top
U7  OPA4314AIPWR  [TSSOP-14_L5.0-W4.4-P0.65-LS6.4-BL]  6.2 32.61 180 top
U8  OPA4314AIPWR  [TSSOP-14_L5.0-W4.4-P0.65-LS6.4-BL]  12.64 14.04 180 top
U9  OPA4314AIPWR  [TSSOP-14_L5.0-W4.4-P0.65-LS6.4-BL]  6.94 7.62 180 top
U13  BMI270  [LGA-14_L3.0-W2.5-P0.50-BR]  13.01 24.87 90 top
U14  BMM150  [WLCSP-12_L1.6-W1.6_BMM150]  13.22 20.37 90 top
USB1  MicroXNJ  [MICRO-USB-SMD_MICROXNJ]  39.64 4.21 0 top

## Footprints (pads in the part's own frame, mm; a bottom-side part is the same pattern mirrored in y, then rotated)
c0402
  rect 0.79x0.54 smd: 1(-0.545,0) 2(0.545,0)
C0402
  rect 0.79x0.54 smd: 1(-0.545,0) 2(0.545,0)
C0603
  rect 0.8x0.9 smd: 1(-0.7,0) 2(0.7,0)
CONN-TH_XH-2AW_C2908611
  round 1.6 hole 1: 1(-1.27,0) 2(1.27,0)
GCU-CON-v2
  rect 1.4x1.4 smd: 1(-0.6,-6) 2(-0.6,-8) 3(-0.6,-10) 4(-0.6,-12) 5(-0.6,-14) 6(-0.6,-16) 7(22.7,-16) 8(22.7,-14) 9(22.7,-12) 10(22.7,-10) 11(22.7,-8) 12(22.7,-6)
LED0603-RD
  rect 0.8x0.8 smd: 1(-0.799,-0.004) 2(0.799,0.004)
LED0603-RD_RED
  rect 0.8x0.8 smd: 1(-0.799,-0.004) 2(0.799,0.004)
LED-SMD_4P-L3.7-W3.5-P1.75-BR-SK6812MINI
  rect 1.5x0.9 smd: 1(1.575,-0.875)
  rect 2.5x0.9 smd: 2(1.175,0.875)
  rect 1.8x0.9 smd: 3(-1.575,0.875)
  rect 2.8x0.9 smd: 4(-1.175,-0.875)
LGA-14_L3.0-W2.5-P0.50-BR
  rect 0.6x0.27 smd: 1(1.17,-0.75) 2(1.17,-0.25) 3(1.17,0.25) 4(1.17,0.75) 8(-1.17,0.75) 9(-1.17,0.25) 10(-1.17,-0.25) 11(-1.17,-0.75)
  rect 0.27x0.6 smd: 5(0.5,0.92) 6(0,0.92) 7(-0.5,0.92) 12(-0.5,-0.92) 13(0,-0.92) 14(0.5,-0.92)
MICRO-USB-SMD_MICROXNJ
  rect 0.4x1.4 smd: 1(-1.3,1.522) 2(-0.65,1.522) 3(0,1.522) 4(0.65,1.522) 5(1.3,1.522)
  round 1.3 hole 0.7: 6(2.425,1.149) 9(-2.425,1.149)
  oval 1.3x2.2 hole 0.7x1.5: 7(3.6,-1.522) 8(-3.6,-1.522)
Pad_e19
  round 4 hole 2.2: 42(0,0)
Pad_e21
  round 4 hole 2.2: 42(0,0)
Pad_e33
  round 4 hole 2.2: 42(0,0)
Pad_e35
  round 4 hole 2.2: 42(0,0)
QFN-28_L5.0-W5.0-P0.50-TL-EP3.3
  rect 0.905x0.28 smd: 1(-2.377,1.5) 2(-2.377,1) 3(-2.377,0.5) 4(-2.377,0) 5(-2.377,-0.5) 6(-2.377,-1) 7(-2.377,-1.5) 15(2.377,-1.5) 16(2.377,-1) 17(2.377,-0.5) 18(2.377,0) 19(2.377,0.5) 20(2.377,1) 21(2.377,1.5)
  rect 0.28x0.905 smd: 8(-1.5,-2.377) 9(-1,-2.377) 10(-0.5,-2.377) 11(0,-2.377) 12(0.5,-2.377) 13(1,-2.377) 14(1.5,-2.377) 22(1.5,2.377) 23(1,2.377) 24(0.5,2.377) 25(0,2.377) 26(-0.5,2.377) 27(-1,2.377) 28(-1.5,2.377)
  rect 3.35x3.35 smd: 29(0,0)
R0402
  rect 0.566x0.54 smd: 1(-0.433,0) 2(0.433,0)
R0603
  rect 0.806x0.864 smd: 1(-0.753,0) 2(0.753,0)
R0805
  rect 1.133x1.377 smd: 1(-1,0) 2(1,0)
SOD-123_L2.7-W1.6-LS3.7-RD
  rect 0.91x1.22 smd: 1(-1.635,0) 2(1.635,0)
SOD-523_L1.2-W0.8-LS1.6-BI
  rect 0.6x0.6 smd: 1(-0.75,0) 2(0.75,0)
SOT-23-3_L2.9-W1.3-P1.90-LS2.4-BR
  rect 1.25x0.7 smd: 1(1,-0.95) 2(1,0.95) 3(-1,0)
SOT-23-5_L2.9-W1.6-P0.95-LS2.8-BL
  rect 0.6x1 smd: 1(-0.95,-1.1) 2(0,-1.1) 3(0.95,-1.1) 4(0.95,1.1) 5(-0.95,1.1)
SOT-23-6_L2.9-W1.6-P0.95-LS2.8-BR
  rect 1.1x0.6 smd: 1(1.35,-0.95) 2(1.35,0) 3(1.35,0.95) 4(-1.35,0.95) 5(-1.35,0) 6(-1.35,-0.95)
SW-SMD_L3.9-W3.0-P4.45
  rect 1.23x1.36 smd: 1(-2.185,0) 2(2.185,0)
SW-TH_MSK12C02
  rect 0.6x1.524 smd: 1(-2.25,1.7) 2(0.75,1.7) 3(2.25,1.7)
  rect 1.2x0.7 smd: 4(-3.6,0.6) 4(-3.6,-1.7) 4(3.6,0.6) 4(3.6,-1.7)
TSSOP-14_L5.0-W4.4-P0.65-LS6.4-BL
  rect 0.4x1.7 smd: 1(-1.95,-2.8) 2(-1.3,-2.8) 3(-0.65,-2.8) 4(0,-2.8) 5(0.65,-2.8) 6(1.3,-2.8) 7(1.95,-2.8) 8(1.95,2.8) 9(1.3,2.8) 10(0.65,2.8) 11(0,2.8) 12(-0.65,2.8) 13(-1.3,2.8) 14(-1.95,2.8)
WIRELM-SMD_ESP32-S3-WROOM-1
  rect 1.5x0.9 smd: 1(-8.75,8.895) 2(-8.75,7.625) 3(-8.75,6.355) 4(-8.75,5.085) 5(-8.75,3.815) 6(-8.75,2.545) 7(-8.75,1.275) 8(-8.75,0.005) 9(-8.75,-1.265) 10(-8.75,-2.535) 11(-8.75,-3.805) 12(-8.75,-5.075) 13(-8.75,-6.345) 14(-8.75,-7.615) 27(8.75,-7.615) 28(8.75,-6.345) 29(8.75,-5.075) 30(8.75,-3.805) 31(8.75,-2.535) 32(8.75,-1.265) 33(8.75,0.005) 34(8.75,1.275) 35(8.75,2.545) 36(8.75,3.815) 37(8.75,5.085) 38(8.75,6.355) 39(8.75,7.625) 40(8.75,8.895)
  rect 0.9x1.5 smd: 15(-6.985,-8.895) 16(-5.715,-8.895) 17(-4.445,-8.895) 18(-3.175,-8.895) 19(-1.905,-8.895) 20(-0.635,-8.895) 21(0.635,-8.895) 22(1.905,-8.895) 23(3.175,-8.895) 24(4.445,-8.895) 25(5.715,-8.895) 26(6.985,-8.865)
  rect 0.9x0.9 smd: 41(-2.9,2.575) 41(-2.9,1.175) 41(-2.9,-0.225) 41(-1.5,2.575) 41(-1.5,1.175) 41(-1.5,-0.225) 41(-0.1,2.575) 41(-0.1,1.175) 41(-0.1,-0.225)
WLCSP-12_L1.6-W1.6_BMM150
  round 0.2 smd: A1(0.566,0.566) A3(0.566,0) A5(0.566,-0.566) B2(0.283,0.283) B4(0.283,-0.283) C1(0,0.566) C5(0,-0.566) D2(-0.283,0.283) D4(-0.283,-0.283) E1(-0.566,0.566) E3(-0.566,0) E5(-0.566,-0.566)

## Nets
As in the schematic, except:
GND: C1.1 C2.1 C4.1 C5.1 C6.1 C7.1 C8.1 C9.1 C10.1 C11.1 C12.2 C13.1 C14.1 C15.1 C16.1 CN1.1 D2.1 D3.1 D4.1 LED1.1 NOREF.42 NOREF#2.42 NOREF#3.42 NOREF#4.42 R5.1 R9.1 R11.1 R13.1 R22.1 SW1.2 SW2.2 SW3.4 U1.1 U1.40 U1.41 U2.2 U3.5 U4.3 U4.29 U6.4 U7.11 U8.11 U9.11 U13.1 U13.6 U13.7 U14.A5 U14.C1 U14.C5 U14.E1 U14.E3 USB1.5 USB1.6 USB1.7 USB1.8 USB1.9
GIN3: R34.1 U8.2
GPIO4: R34.2 U1.4 U8.1

Pads without a net: H1 1 2 3 4 5 6 7 8 9 10 11 12; H2 1 2 3 4 5 6 7 8 9 10 11 12; U1 8 9 10 16 19 20 21 22; U2 4; U4 1 2 10 12 13 14 15 16 17 18 19 20 21 22 23 27; U6 3; U13 2 3 4 9 10 11; U14 D2 D4; USB1 4

## Via types
v1: diameter 0.305, hole 0.203, Top Layer to Bottom Layer, 1 via
v2: diameter 0.61, hole 0.305, Top Layer to Bottom Layer, 86 vias

## Routing (per net, layer and track width the routed paths; a pad name or vN(x,y) marks a point on that pad's centre or on a via; arc(x,y) is an arc through that point)
GND: length 326.3
  Top Layer w0.254: 13.76,26.04 13.76,26.6 ; 13.76,26.6 13.62,26.74 13.31,26.74 12.35,27.71 ; 13.76,26.6 14.04,26.87 14.04,29.15 14.52,29.63 14.72,29.63 15.75,30.65 15.75,31.52 14.97,32.3 14.54,32.3 ; 9.29,38.02 9.29,38.55 ; 9.29,38.55 9.47,38.73 13.13,38.73 13.49,38.38 ; 9.29,38.55 9.12,38.71 3.15,38.71 NOREF#4.42 2.54,35.43 6.2,31.77 U7.11 ; 11.01,26.06 11.01,26.71 12,27.7 12.35,27.71 ; 11.01,26.06 C13.1 ; 11.01,26.06 11.01,24.77 11.42,24.37 ; 27.87,8.22 27.87,7.8 27.16,7.09 21.27,7.09 21.19,7.01 ; 27.87,8.22 25.08,11.01 24.25,11.01 ; 27.87,8.22 30.93,11.29 SW1.2 33.96,13.82 31.49,16.29 31.49,16.84 32.01,16.84 ; U14.E1 12.44,20.01 12.44,20.16 U14.C1 ; U14.E1 12.76,19.69 13.11,19.69 U14.E3 ; U14.E1 11.96,19.8 ; NOREF.42 3.58,3.58 6.94,3.58 6.94,3.72 ; 16.52,0.74 SW3.4 9.93,0.74 6.94,3.72 ; 16.52,0.74 22.01,0.74 ; 16.52,0.74 16.52,3.04 16.43,3.04 ; 13.49,38.38 13.49,38.7 14.33,39.54 18.76,39.54 23.77,34.53 23.77,33.05 v2(24.47,33.05) U1.41 v2(25.87,33.05) U1.41 27.28,33.05 33.6,39.37 U1.40 36.43,39.37 36.83,39.78 46.58,39.78 NOREF#3.42 45.89,35.73 ; 13.49,38.38 13.49,36.67 14.48,35.67 ; U2.2 21.19,7.01 ; 21.19,7.01 21.03,7.17 18,7.17 17.4,6.57 16.62,6.57 ; C16.1 11.71,19.55 11.96,19.8 ; 14.54,32.3 12.97,30.72 C12.2 ; 14.54,32.3 14.18,32.3 12.74,33.74 12.74,34.19 13.05,34.5 13.31,34.5 14.48,35.67 ; R9.1 39.3,8.19 38.85,8.64 ; 45.89,35.73 45.89,32.48 48.2,30.17 48.73,30.17 48.73,29.76 ; 45.89,35.73 R13.1 ; USB1.8 25.28,2.69 24.23,3.73 ; 16.43,3.04 15.66,3.04 ; 16.43,3.04 16.43,6.39 16.62,6.57 ; 42.07,5.36 41.32,5.36 40.94,5.73 ; 26.57,30.25 v2(25.87,30.25) v2(24.47,30.25) 23.77,30.25 ; 40.44,36.56 39.94,36.06 39.94,33.48 39.95,33.47 v2(39.95,32.12) 39.95,31.29 ; 16.62,6.57 16.36,6.57 12.79,10.14 12.64,10.14 12.64,11.24 ; 23.77,31.66 v2(24.47,31.66) U1.41 v2(25.87,31.66) U1.41 ; 14.03,20.69 14.07,20.73 14.54,20.73 14.43,20.61 ; 14.03,20.69 14.03,20.61 U14.C5 ; 14.03,20.69 U14.A5 ; C4.1 44.89,9.03 ; 44.89,9.03 39.31,9.03 39.27,9.07 ; 44.89,9.03 44.89,8.83 45.82,7.89 45.82,7.7 49.07,7.7 49.07,7.34 49.84,6.57 49.84,4.12 NOREF#2.42 43.39,2.54 USB1.7 ; 24.25,14.48 21.5,14.48 15.9,20.08 15.9,20.61 C15.1 14.43,20.61 ; 24.25,14.48 C11.1 ; 24.25,14.48 24.25,11.01 ; 14.43,20.61 v2(14.33,20.51) ; 6.94,3.72 6.94,4.82 ; 39.84,13 41.81,14.98 41.81,23.65 40.21,25.26 LED1.1 40.86,25.91 44.7,29.76 48.73,29.76 ; 39.84,13 39.84,13.74 ; 39.84,13 39.84,12.26 39.27,11.7 R5.1 39.27,9.07 ; 11.96,19.8 v2(11.96,19.82) ; R11.1 48.73,29.76 ; 39.27,9.07 38.85,8.64 ; 24.23,3.73 23.72,3.22 23.72,3.04 22.01,3.04 22.01,0.74 ; 24.23,3.73 24.23,4.38 ; 11.42,24.37 12.65,24.37 12.65,24.87 12.09,24.87 ; 11.42,24.37 11.01,23.96 C14.1 ; 12.35,27.71 12.35,27.89 12.18,28.06 12.18,28.59 ; 14.48,35.67 15.01,35.67 ; 39.95,31.29 C5.1 ; 39.95,31.29 39.66,31.29 39.64,31.27 38.25,31.27 ; 24.25,11.01 SW2.2 ; 22.01,0.74 SW3.4 ; 38.85,8.64 36.79,8.64
  信号层1 w0.254: v2(14.33,20.51) 13.64,19.82 v2(11.96,19.82) ; v2(39.95,32.12) 39.9,32.07 26.86,32.07 v2(26.57,32.35)
  Bottom Layer w0.254: U1.41 v2(26.57,30.95) ; U1.41 v2(25.87,31.66) ; U1.41 v2(26.57,32.35) ; USB1.8 37.22,3.86 USB1.9 42.07,5.36 42.07,3.86 USB1.7 ; U1.41 v2(25.17,32.35) ; U1.41 v2(25.17,30.95) ; U1.41 v2(25.87,31.66) ; v2(23.77,30.95) 23.77,31.66 ; 23.77,31.66 v2(24.47,31.66) ; 23.77,31.66 v2(23.77,32.35) ; v2(25.87,31.66) v2(25.87,30.25) ; v2(25.87,31.66) v2(25.87,33.05)
VBAT: length 46.4
  Top Layer w0.254: 40.38,21.93 40.38,21.41 40.33,21.41 37.89,18.97 37.89,18.68 36.43,17.22 36.43,12.01 34.66,10.24 33.41,10.24 33.1,9.93 33.1,8.83 33.29,8.64 ; 33.29,8.64 31.25,8.64 28.08,5.47 24.23,5.47 ; 33.29,8.64 34.09,8.64 ; 17.02,4.14 17.02,5.16 20.02,5.16 20.02,4.14 20.85,3.31 v2(20.85,2.99)
  Bottom Layer w0.254: v2(20.85,2.99) 25.6,2.99 30.41,7.8
VBUS: length 44.5
  Top Layer w0.254: v2(47.67,31.58) R10.2 ; v2(46.57,5.47) 46.4,5.65 46.38,5.65 D2.2 45.82,6.2 44.26,7.76 41.02,7.76 40.37,7.12 38.78,7.12 38.34,6.69 ; 38.34,5.73 38.34,6.69 ; 38.34,6.69 36.46,6.69 35.83,7.32 35.83,9.59 36.79,9.59
  Bottom Layer w0.254: v2(46.57,5.47) 47.67,6.58 v2(47.67,31.58)
VCC_3V3: length 148.9
  Top Layer w0.254: U14.B2 U14.A1 ; U14.A1 11.01,22.58 11.01,22.87 ; U14.A1 12.42,20.7 11.68,20.7 11.62,20.64 C16.2 10.35,20.64 10.35,19.22 10.71,18.85 11.71,18.85 12.64,17.92 ; 12.26,23.17 12.46,22.97 13.94,22.97 14.49,23.52 14.49,24.37 13.93,24.37 ; 12.26,23.17 U13.8 ; 12.26,23.17 12.26,23.15 11.28,23.15 11.01,22.87 ; 20.24,12.21 U2.5 20.24,7.7 17.44,7.7 17.4,7.66 16.88,7.66 ; 20.24,12.21 v2(20.92,12.21) ; 20.24,12.21 20.24,15.2 15.92,19.52 C15.2 14.85,19.52 ; 41.94,33.55 41.94,33.48 42.02,33.4 44.72,33.4 44.72,30.41 44.62,30.27 R3.2 41.97,30.27 41.59,29.89 C5.2 40.36,29.24 40.38,29.22 R1.1 40.38,27.21 40.18,27.21 39.5,26.53 39.5,25.08 v2(39.54,25.04) ; 41.94,33.55 41.94,34.19 ; 41.94,33.55 41.86,33.48 41.44,33.48 41.44,34.19 ; U6.2 38.08,17.6 38.5,18.01 v2(38.5,18.54) ; C8.2 13.27,28.85 ; 13.27,28.85 12.98,29.14 10.52,29.14 ; 13.27,28.85 13.27,29.11 14.71,30.55 14.97,30.55 14.97,31.21 ; 10.52,30.73 9.62,30.73 v2(9.59,30.76) 9.59,30.07 10.52,29.14 ; v2(11.62,26.44) 11.62,25.45 11.54,25.37 U13.5 ; 14.85,19.52 13.44,18.12 12.64,18.12 12.64,17.92 ; 14.85,19.52 14.57,19.8 U14.E5 ; 11.01,22.87 10.36,22.87 9.7,23.53 9.7,27.15 C13.2 10.37,27.8 10.52,27.95 10.52,29.14 ; 6.18,38.03 6.18,37.51 6.2,37.49 v2(6.2,36.91) U7.4 ; 6.94,10.42 6.94,12.15 v2(8.28,13.49) ; R19.1 15.13,38.92 v2(14.97,38.92) ; 12.64,17.92 12.64,16.84
  信号层1 w0.254: v2(9.59,30.76) 11.62,28.73 v2(11.62,26.44) ; v2(20.92,12.21) 32.17,12.21 v2(38.5,18.54) 39.54,19.58 v2(39.54,25.04)
  Bottom Layer w0.254: 8.61,36.91 v2(6.2,36.91) ; 8.61,36.91 9.59,35.93 v2(9.59,30.76) ; 8.61,36.91 8.61,37.09 10.44,38.92 v2(14.97,38.92) ; v2(11.62,26.44) 10.7,25.52 10.7,15.91 v2(8.28,13.49)
VCC_5V: length 2.6
  Top Layer w0.254: C4.2 44.19,10.88 44.03,11.04 42.38,11.04
(no net): length 5.1
  Top Layer w0.254: 4.45,19.05 6.98,19.05 ; 4.45,13.97 6.98,13.97
  vias: v1(13.35,20.47)
CHIP_PU: length 34.7
  Top Layer w0.254: C11.2 25.45,18.12 25.49,18.07 26.02,18.07 ; C11.2 23.73,18.12 22.43,16.82 22.43,15.38 ; C11.2 24.25,18.77 v2(23.62,18.77) ; R20.1 14.78,37.44 15.38,36.83 15.53,36.83 ; 15.53,36.83 15.64,36.73 15.64,34.58 15.01,34.58 ; 15.53,36.83 U1.3 19,36.83 v2(20.2,35.64)
  Bottom Layer w0.254: v2(23.62,18.77) 20.59,21.79 20.59,35.25 v2(20.2,35.64)
DTR: length 33.7
  Top Layer w0.254: v2(37.18,34.81) 37.18,34.89 37.35,35.07 U4.28 ; 28.55,9.97 28.55,10.5 30.8,12.74 31.09,12.74 31.09,13.19 ; Q4.2 31.09,13.19 ; 31.09,13.19 26.7,17.59 v2(26.7,18.75)
  Bottom Layer w0.254: v2(37.18,34.81) 26.7,24.33 v2(26.7,18.75)
ESP_3V3: length 4.2
  Top Layer w0.254: U1.2 16.92,38.1 16.27,37.45 ; 16.27,37.45 R19.2 15.61,37.45 14.81,38.26 14.39,38.26 R20.2
GIN0: length 23.9
  Top Layer w0.254: v2(10.34,37.9) R23.1 ; v2(4.9,34.11) 4.9,35.41
  Bottom Layer w0.254: v2(4.9,34.11) 7.25,31.77 7.25,30.15 ; 7.25,30.15 6.85,29.75 6.85,26.8 6.98,26.67 4.45,26.67 ; 7.25,30.15 9.91,30.15 10.28,30.52 10.28,37.84 v2(10.34,37.9)
GIN1: length 23.6
  Top Layer w0.254: 4.9,29.81 4.9,28.62 4.22,28.62 3.03,27.43 3.03,25.55 4.45,24.13 ; v2(10.96,34.41) 10.7,34.68 10.55,34.68 R24.1
  Bottom Layer w0.254: v2(10.96,34.41) 10.96,27.35 7.75,24.13 4.45,24.13
GIN2: length 21.2
  Top Layer w0.254: 6.98,21.59 4.45,21.59 ; v2(7.5,28.54) U7.13 7.5,30.95 9.38,32.82 R25.1
  Bottom Layer w0.254: v2(7.5,28.54) 7.69,28.54 8.38,27.85 8.38,25.84 7.94,25.4 4.07,25.4 3.14,24.47 3.14,22.9 4.45,21.59
GIN3: length 23.5
  Top Layer w0.254: 16.79,15.84 16.13,15.84 15.79,15.51 14.16,15.51 13.93,15.74 ; v2(13.17,15.01) 13.21,15.01 13.93,15.74 ; 13.93,15.74 13.93,16.84
  Bottom Layer w0.254: 6.98,19.05 5.72,17.78 5.72,13.52 9.24,10 10.27,10 13.17,12.9 v2(13.17,15.01)
GIN4: length 16.1
  Top Layer w0.254: 16.79,13.81 13.17,13.81 11.34,15.64 11.34,18 8.48,18 6.98,16.51 4.45,16.51
GIN5: length 12.5
  Top Layer w0.254: 11.48,12.5 11.76,12.78 15.12,12.78 16.13,11.78 16.79,11.78 ; 11.48,12.5 11.48,12.76 v2(11.49,12.77) ; 11.48,12.5 11.48,12.49 11.34,12.35 11.34,11.24
  Bottom Layer w0.254: 6.98,13.97 6.98,13.81 8.03,12.77 v2(11.49,12.77)
GIN6: length 46.8
  Top Layer w0.254: 46.36,26.67 43.81,26.67 ; 13.93,11.24 13.93,10.14 14.86,9.21 16.79,9.21 16.79,9.74 v2(15.96,9.74)
  Bottom Layer w0.254: v2(15.96,9.74) 23.73,9.74 29.01,15.03 29.01,21.24 34.44,26.67 43.81,26.67
GIN7: length 4.1
  Top Layer w0.254: 8.24,10.42 8.24,9.22 9.29,9.22 10.12,8.39 10.78,8.39
GIN8: length 7.4
  Top Layer w0.254: 5.64,10.42 5.64,9.29 8.36,6.58 10.78,6.58
GIN9: length 7.4
  Top Layer w0.254: 10.78,4.76 10.12,4.76 10.12,5.09 9.22,5.98 8.2,5.98 7.72,6.46 6.18,6.46 5.64,5.93 5.64,4.82
GIN10: length 4
  Top Layer w0.254: U9.13 8.24,3.71 9.01,2.95 10.78,2.95
GPIO0: length 11.9
  Top Layer w0.254: 32.54,17.93 33.94,16.53 33.96,16.53 33.96,15.66 ; 32.54,17.93 34.42,19.81 34.42,22.86 35.42,22.86 ; 32.54,17.93 30.89,17.93 30.79,18.04 R18.2
GPIO1: length 34.9
  Top Layer w0.254: 12.69,37.9 12.69,36.88 v2(12.86,36.7) ; U7.7 4.21,35.36 v2(3.61,35.36) ; v2(32.84,37.05) 33.9,38.1 U1.39
  信号层1 w0.254: v2(32.84,37.05) 13.2,37.05 v2(12.86,36.7) 11.52,35.36 v2(3.61,35.36)
GPIO2: length 35.8
  Top Layer w0.254: v2(31.95,36.3) 33.88,36.3 34.42,36.83 U1.38 ; v2(13.08,35.18) 12.9,35.18 12.71,35.36 R24.2 ; v2(5.24,31.64) 4.51,30.92 4.25,30.92 U7.8
  信号层1 w0.254: v2(5.24,31.64) 9.55,31.64 v2(13.08,35.18) 14.2,36.3 v2(31.95,36.3)
GPIO3: length 22.5
  Top Layer w0.254: 11.39,31.67 11.39,32.82 R25.2 ; 11.39,31.67 8.91,31.67 8.15,30.92 U7.14 ; 11.39,31.67 v2(12.77,31.67) ; 19.69,21.58 v2(16.82,21.58)
  Bottom Layer w0.254: v2(12.77,31.67) 16.82,27.61 v2(16.82,21.58)
GPIO4: length 26.3
  Top Layer w0.254: 16.99,16.81 16.41,17.4 14.58,17.4 14.58,16.84 ; 16.99,16.81 16.99,16.89 v2(17.07,16.97) ; 16.99,16.81 17.11,16.81 17.64,16.29 17.64,15.84 18.3,15.84 ; U1.4 17.93,35.55 v2(19.18,35.55)
  Bottom Layer w0.254: v2(19.18,35.55) 19.18,21.09 19.48,20.79 19.48,19.38 v2(17.07,16.97)
GPIO5: length 34.3
  Top Layer w0.254: v2(13.41,33.93) 13.52,33.82 16.44,33.82 16.92,34.29 U1.5 ; 10.69,16.84 10.26,17.27 v2(10.05,17.27) ; R27.2 18.3,14.61 v2(18.55,14.86)
  信号层1 w0.254: v2(10.05,17.27) 11.04,16.28 17.13,16.28 v2(18.55,14.86)
  Bottom Layer w0.254: v2(13.41,33.93) 11.4,31.91 11.4,27.12 10.05,25.77 v2(10.05,17.27)
GPIO6: length 33.1
  Top Layer w0.254: 18.4,11.79 17.55,12.65 15.86,12.65 15.32,13.19 12.16,13.19 v2(11.65,13.71) 11.58,13.64 11.16,13.64 10.69,13.17 10.69,11.73 ; v2(14.69,28.82) 14.74,28.82 16.68,30.76 16.68,33.02 U1.6
  Bottom Layer w0.254: v2(11.65,13.71) 11.33,14.02 11.33,25.16 14.69,28.52 v2(14.69,28.82)
GPIO7: length 30.5
  Top Layer w0.254: 14.58,11.24 14.58,10.14 14.97,10.14 15.55,10.72 17.27,10.72 17.6,10.38 17.6,10.11 ; R29.2 17.64,9.74 17.64,10.08 17.6,10.11 ; v2(18.12,10.62) 17.6,10.11 ; U1.7 v2(19.96,31.75)
  Bottom Layer w0.254: v2(18.12,10.62) 19.96,12.47 v2(19.96,31.75)
GPIO8: length 26
  Top Layer w0.254: 12.29,8.39 11.63,8.39 11.63,8.86 9.92,10.56 v2(9.92,10.63) 9.92,10.82 9.22,11.53 8.89,11.53 8.89,10.42 ; v2(12.59,22.33) 13.97,22.33 16.92,25.28 16.92,25.4 U1.12
  Bottom Layer w0.254: v2(12.59,22.33) 12.59,12.84 10.37,10.63 v2(9.92,10.63)
GPIO9: length 33.1
  Top Layer w0.254: 22.22,21.58 22.22,20.74 21.9,20.42 18.59,20.42 v2(18.56,20.45) ; 12.29,6.58 12.34,6.52 v2(13.83,6.52) ; 4.99,10.42 4.99,11.56 v2(5.15,11.71)
  Bottom Layer w0.254: 13.93,9.61 7.25,9.61 v2(5.15,11.71) ; 13.93,9.61 13.93,15.83 v2(18.56,20.45) ; 13.93,9.61 13.83,9.51 v2(13.83,6.52)
GPIO10: length 34.7
  Top Layer w0.254: 12.29,4.76 12.95,4.76 13.13,4.95 v2(13.25,4.95) ; v2(5.23,6.63) 4.99,6.4 U9.8 ; v2(18.79,19.62) 19.05,19.88 22.79,19.88 23.5,20.58 23.5,21.58
  信号层1 w0.254: v2(13.25,4.95) 6.91,4.95 v2(5.23,6.63)
  Bottom Layer w0.254: v2(18.79,19.62) 15.15,15.97 15.15,6.84 v2(13.25,4.95)
GPIO11: length 5
  Top Layer w0.254: U9.14 8.89,3.71 11.29,3.71 11.8,3.21 11.8,2.95 12.29,2.95
GPIO19: length 28.6
  Top Layer w0.254: v2(33.33,24.37) 18.16,24.37 U1.13 ; 46.36,24.13 43.81,24.13
  Bottom Layer w0.254: 43.81,24.13 33.57,24.13 v2(33.33,24.37)
GPIO20: length 29.5
  Top Layer w0.254: v2(32.86,23.5) 19.56,23.5 18.93,22.86 17.92,22.86 ; 46.36,21.59 43.81,21.59
  Bottom Layer w0.254: v2(32.86,23.5) 32.93,23.57 41.83,23.57 43.81,21.59
GPIO21: length 18.3
  Top Layer w0.254: v2(29.84,20.39) 29.84,21.58 ; 46.36,19.05 43.81,19.05
  Bottom Layer w0.254: v2(29.84,20.39) 30.95,19.28 43.58,19.28 43.81,19.05
GPIO35: length 16.4
  Top Layer w0.254: 46.36,16.51 43.81,16.51 42.49,17.84 v2(42.49,20.21) ; v2(36.66,21.92) 36.66,23.48 36.01,24.13 U1.28
  Bottom Layer w0.254: v2(36.66,21.92) 38.36,20.21 v2(42.49,20.21)
GPIO36: length 34.2
  Top Layer w0.254: U1.29 36.43,25.4 37.39,24.44 37.39,19.01 v2(37.07,18.69) ; 46.36,13.97 43.81,13.97
  Bottom Layer w0.254: v2(37.07,18.69) 37.07,9.78 40.5,6.35 41.67,6.35 43.81,8.49 43.81,13.97
GPIO38: length 13.1
  Top Layer w0.254: 35.45,27.89 36.65,27.89 37.56,26.97 37.56,25.19 38.46,25.19 39.37,24.28 39.37,23.27 40.11,22.52 40.79,22.52 41.26,22.05 41.26,20.07 40.37,19.18
RTS: length 32.8
  Top Layer w0.254: 27.1,13.18 v2(26.31,13.18) ; 27.1,13.18 27.1,12.74 27.53,12.31 27.7,12.31 27.7,11.78 ; 27.1,13.18 27.1,13.62 ; 38.06,37.06 v2(36.8,37.06)
  Bottom Layer w0.254: v2(26.31,13.18) 25.9,13.59 25.9,26.16 v2(36.8,37.06)
SCL: length 45.6
  Top Layer w0.254: v2(32.36,26.47) 33.96,24.86 33.96,23.7 33.1,22.84 31.53,22.84 31.15,22.46 31.15,21.61 31.12,21.58 ; v2(13.34,24.88) 13.35,24.87 13.93,24.87 ; v2(13.22,21.47) U14.A3 ; v2(43.23,30.99) 43.42,30.99 43.57,31.14 R3.1
  信号层1 w0.254: v2(13.34,24.88) 14.94,26.47 v2(32.36,26.47)
  Bottom Layer w0.254: v2(32.36,26.47) 36.89,30.99 v2(43.23,30.99) ; v2(13.34,24.88) 13.34,21.59 v2(13.22,21.47)
SDA: length 47.2
  Top Layer w0.254: 13.51,20.66 13.35,20.5 13.35,20.47 ; U13.14 14.68,25.37 14.68,25.03 v2(15.25,24.46) ; 42.49,31.14 41.84,31.14 41.28,30.57 39.52,30.57 v2(39.21,30.26) ; 32.38,21.58 32.38,20.58 31.5,19.7 v2(28.29,19.7)
  信号层1 w0.254: v2(28.29,19.7) 23.53,24.46 v2(15.25,24.46) 14.59,23.8 14.59,21.72 13.35,20.47
  Bottom Layer w0.254: v2(39.21,30.26) 37.39,30.26 28.29,21.15 v2(28.29,19.7)
U0RXD: length 3.8
  Top Layer w0.254: U1.36 36.43,34.29 36.43,34.94 37.55,36.07 U4.26
U0TXD: length 3.1
  Top Layer w0.254: 38.06,36.56 37.35,36.56 37.35,36.49 36.43,35.56 U1.37
USB_D+: length 48
  Top Layer w0.254: 40.44,34.19 40.44,33.48 40.54,33.37 v2(40.54,32.89) ; 49.1,6.22 49.1,5.55 v2(49.02,5.48) 48.08,5.48 47.13,4.53 45.72,4.53 45.46,4.28 40.16,4.28 39.65,4.79 39.65,5.7
  Bottom Layer w0.254: v2(49.02,5.48) 49.02,31.25 47.39,32.89 v2(40.54,32.89)
USB_D-: length 43.2
  Top Layer w0.254: 38.98,5.69 39.03,5.74 39.03,6.59 39.21,6.76 40.52,6.76 40.55,6.81 41.02,6.81 v2(41.19,6.98) 43.62,6.98 45.72,4.89 46.99,4.89 47.77,5.67 47.77,6.2 ; 40.94,34.19 40.94,33.67 41.07,33.54 41.07,33.18 42.04,32.21 v2(43.22,32.21)
  Bottom Layer w0.254: v2(43.22,32.21) 44.99,30.43 44.99,18.55 44.22,17.78 43.34,17.78 41.19,15.64 v2(41.19,6.98)
VOUT1: length 84.6
  Top Layer w0.254: 7.59,10.42 7.59,9.32 ; 7.59,9.32 9.3,7.6 12.81,7.6 12.93,7.72 ; 7.59,9.32 7.53,9.25 6.29,9.25 6.29,11.56 5.27,12.59 3.88,12.59 3.25,13.21 3.25,16.94 4.09,17.78 7.67,17.78 8.31,18.41 ; U7.10 5.55,28.7 5.88,28.7 ; 13.28,16.84 13.28,15.6 11.99,15.6 11.99,17.95 11.52,18.41 8.31,18.41 ; 5.88,28.7 5.73,28.55 5.73,25.83 6.16,25.4 7.31,25.4 8.31,24.41 8.31,18.41 ; 5.88,28.7 5.98,28.6 6.85,28.6 U7.12 6.85,34.26 ; U7.1 8.15,34.3 7.77,34.3 7.5,34.57 U7.2 ; 12.93,7.72 13.15,7.94 13.15,8.88 11.99,10.04 11.99,12.43 13.28,12.43 13.28,11.24 ; 12.93,7.72 13.59,7.72 14.56,6.75 14.56,3.57 12.98,2 9.24,2 7.59,3.65 U9.12 7.59,6.02 6.4,6.02 6.29,5.91 6.29,4.82 ; 7.51,34.52 7.24,34.26 5.84,34.26 5.52,34.59 5.52,35.24
$1N2540: length 2.4
  Top Layer w0.254: R1.2 39.52,27.21 38.87,26.56 38.61,26.56 38.61,25.91
$1N5698: length 4.8
  Top Layer w0.254: 34.09,9.59 34.96,9.59 35.66,10.3 37.49,10.3 37.87,9.92 38.41,9.92
$1N5744: length 2.4
  Top Layer w0.254: 39.52,21.93 39.52,22.46 39.29,22.46 38.61,23.14 38.61,23.79
$1N5776: length 20.4
  Top Layer w0.254: LED2.1 40.21,23.15 40.99,23.15 v2(41.21,22.93) ; 34.09,7.69 34.9,7.69 34.9,7.94 v2(35.25,8.29)
  信号层1 w0.254: v2(41.21,22.93) 41.21,14.25 v2(35.25,8.29)
$1N6032: length 1.7
  Top Layer w0.254: 38.43,7.67 37.62,7.67 37.6,7.69 36.79,7.69
$1N7305: length 21.4
  Top Layer w0.254: v2(42.54,34.48) 43.23,34.48 43.52,34.78 43.52,35.07 U4.8 ; R11.2 49.59,31.05 49.59,31.06 R10.1 49.59,32.11 49.4,32.11 v2(48.81,32.69) ; v2(38.73,32.68) 38.35,32.68 37.47,31.8 37.47,30.66 37.6,30.53 38.25,30.53 38.25,29.87
  信号层1 w0.254: v2(42.54,34.48) 47.02,34.48 v2(48.81,32.69)
  Bottom Layer w0.254: v2(42.54,34.48) 40.53,34.48 v2(38.73,32.68)
$1N7502: length 2.6
  Top Layer w0.254: U4.9 43.68,35.57 44.62,34.63 R12.1
$1N7540: length 1.8
  Top Layer w0.254: 44.63,36.6 43.56,36.6 43.52,36.56 42.81,36.56
$1N7794: length 2.8
  Top Layer w0.254: 39.52,19.19 39.52,18.67 39.84,18.35 39.84,16.49
$1N8190: length 1.6
  Top Layer w0.254: 26.02,17.21 26.02,16.67 26.15,16.54 26.15,15.62
$1N8194: length 1.6
  Top Layer w0.254: 30.14,15.62 30.14,16.5 30.26,16.62 R18.1
$1N8229: length 4.8
  Top Layer w0.254: 25.2,13.62 25.2,12.74 25.44,12.74 27.69,10.5 27.69,9.97
$1N8232: length 2.2
  Top Layer w0.254: 28.56,11.78 28.56,12.31 28.76,12.31 29.19,12.74 Q4.1
$1N11489: length 4.1
  Top Layer w0.254: 8.42,38.02 7.59,38.02 7.58,38.03 7.05,38.03 7.05,37.51 6.85,37.31 U7.3
$1N12314: length 4.9
  Top Layer w0.254: U2.1 20.24,5.5 20.66,5.5 21.51,4.64 ; 21.51,4.64 21.51,4.14 ; 21.51,4.64 21.51,5.16 21.86,5.5 22.14,5.5 U2.3

## Copper pours and planes (outline as drawn; the poured copper is in the pictures)
GND on 地线屏蔽层: 0.26,40.38 50.54,40.38 50.54,0.26 0.26,0.26

Small or netless copper shapes (teardrops, artwork), in the pictures only: 444 on Top Layer, 96 on Bottom Layer, 28 on 地线屏蔽层, 32 on 信号层1

## Text on the board
Top Silkscreen Layer: JLab   Ver 2.0.B | Designed by PrestonYu
